# Altium project Oster-Platine.PrjPCB
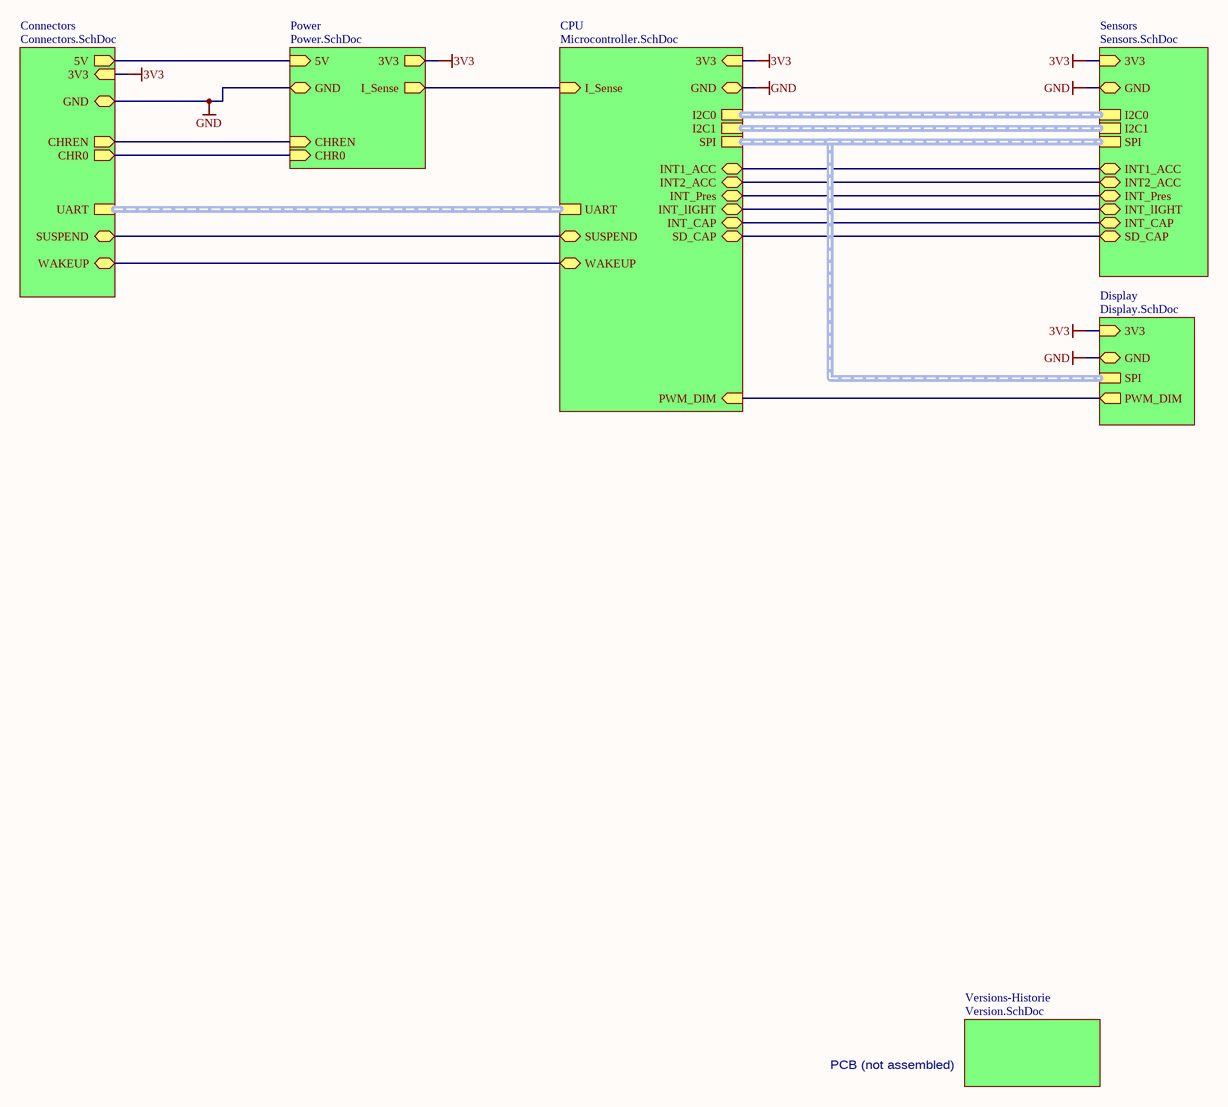
[diagram p0: Overview.SchDoc]
BAUGRUPPE: Bunny-PCB; PN1: 00400; PN2: 28669; PN3: 1; PN4: A
7 sheets, 136 parts. Net scope: strictly hierarchical (ports join the sheet entries above them; power ports are local).
Board file: Oster-Platine.PcbDoc
Sheets:
  Overview.SchDoc
    Versions-Historie = Version.SchDoc
    CPU = Microcontroller.SchDoc
    Display = Display.SchDoc
    Sensors = Sensors.SchDoc
    Power = Power.SchDoc
    Connectors = Connectors.SchDoc

## Sheet Overview.SchDoc
size 393 x 281 mm; Organization: iMAR GmbH; Address1: Im Reihersbruch 3; Address2: D-66386 St. Ingbert; Address3: www.imar.de; DocumentNumber: 2; SheetNumber: 2; SheetTotal: 7; Abteilung: Entwicklung

### Parts
PCB_(not_assembled)  PCB (not assembled)  (value not drawn)  (mechanical)

### Sub-sheets
Connectors = Connectors.SchDoc: 5V (out), GND (bidir), UART (harness UART), SUSPEND (bidir), WAKEUP (bidir), 3V3 (in), CHREN (out), CHR0 (out)
CPU = Microcontroller.SchDoc: 3V3 (in), GND (bidir), I2C0 (harness I2C), I2C1 (harness I2C), SPI (harness SPi), UART (harness UART), SUSPEND (bidir), WAKEUP (bidir), INT1_ACC (bidir), INT2_ACC (bidir), INT_Pres (bidir), INT_lIGHT (bidir), INT_CAP (bidir), SD_CAP (bidir), PWM_DIM (in), I_Sense (in)
Display = Display.SchDoc: SPI (harness SPI), 3V3 (in), GND (bidir), PWM_DIM (out)
Power = Power.SchDoc: 5V (in), 3V3 (out), GND (bidir), I_Sense (out), CHREN (in), CHR0 (in)
Sensors = Sensors.SchDoc: I2C0 (harness I2C), I2C1 (harness I2C), SPI (harness SPI), 3V3 (in), GND (bidir), INT1_ACC (bidir), INT2_ACC (bidir), INT_Pres (bidir), INT_lIGHT (bidir), INT_CAP (bidir), SD_CAP (bidir)
Versions-Historie = Version.SchDoc: no entries

### Nets
3V3: sheet CPU/3V3, sheet Display/3V3, sheet Sensors/3V3, sheet Power/3V3, sheet Connectors/3V3
5V: sheet Power/5V, sheet Connectors/5V
GND: sheet CPU/GND, sheet Display/GND, sheet Sensors/GND, sheet Power/GND, sheet Connectors/GND
CHR0: sheet Power/CHR0, sheet Connectors/CHR0
CHREN: sheet Power/CHREN, sheet Connectors/CHREN
I_Sense: sheet CPU/I_Sense, sheet Power/I_Sense
INT1_ACC: sheet CPU/INT1_ACC, sheet Sensors/INT1_ACC
INT2_ACC: sheet CPU/INT2_ACC, sheet Sensors/INT2_ACC
INT_CAP: sheet CPU/INT_CAP, sheet Sensors/INT_CAP
INT_lIGHT: sheet CPU/INT_lIGHT, sheet Sensors/INT_lIGHT
INT_Pres: sheet CPU/INT_Pres, sheet Sensors/INT_Pres
PWM_DIM: sheet CPU/PWM_DIM, sheet Display/PWM_DIM
SD_CAP: sheet CPU/SD_CAP, sheet Sensors/SD_CAP
SUSPEND: sheet CPU/SUSPEND, sheet Connectors/SUSPEND
WAKEUP: sheet CPU/WAKEUP, sheet Connectors/WAKEUP

### Buses and harness runs
harness sheet Connectors/UART = sheet CPU/UART
harness sheet CPU/I2C0 = sheet Sensors/I2C0
harness sheet CPU/I2C1 = sheet Sensors/I2C1
harness sheet CPU/SPI = sheet Display/SPI = sheet Sensors/SPI

### Notes on the sheet
- Date/Datum
- Name
- Identification No./Modell Nr.
- Classification/
- Checked
- Approved
- Issued
- Designation/Benennung
- Revision-Character/Versions-Buchstabe
- Verwendungsbereich
- Drawn/Hersteller
- Dept./Abt.
- iMAR Navigation GmbH
- Rev./Ver.
- Drawing No./Zeichnungsnummer
- Sheet/Blatt
- /
- Im Reihersbruch 3
- D-66386 St. Ingbert
- www.imar.de <http://www.imar.de>
- Filename/Dateiname
- Format
- A3

### Library data of the parts
PCB_(not_assembled) = CMP-ROOT-0069-7: iMAR_Partnumber: 00400-28669-1xxA; iMAR_Description: Bunny-PCB

## Sheet Version.SchDoc
size 393 x 281 mm; Organization: iMAR GmbH; Address1: Im Reihersbruch 3; Address2: D-66386 St. Ingbert; Address3: www.imar.de; DocumentNumber: 1; SheetNumber: 1; SheetTotal: 7; Abteilung: Entwicklung
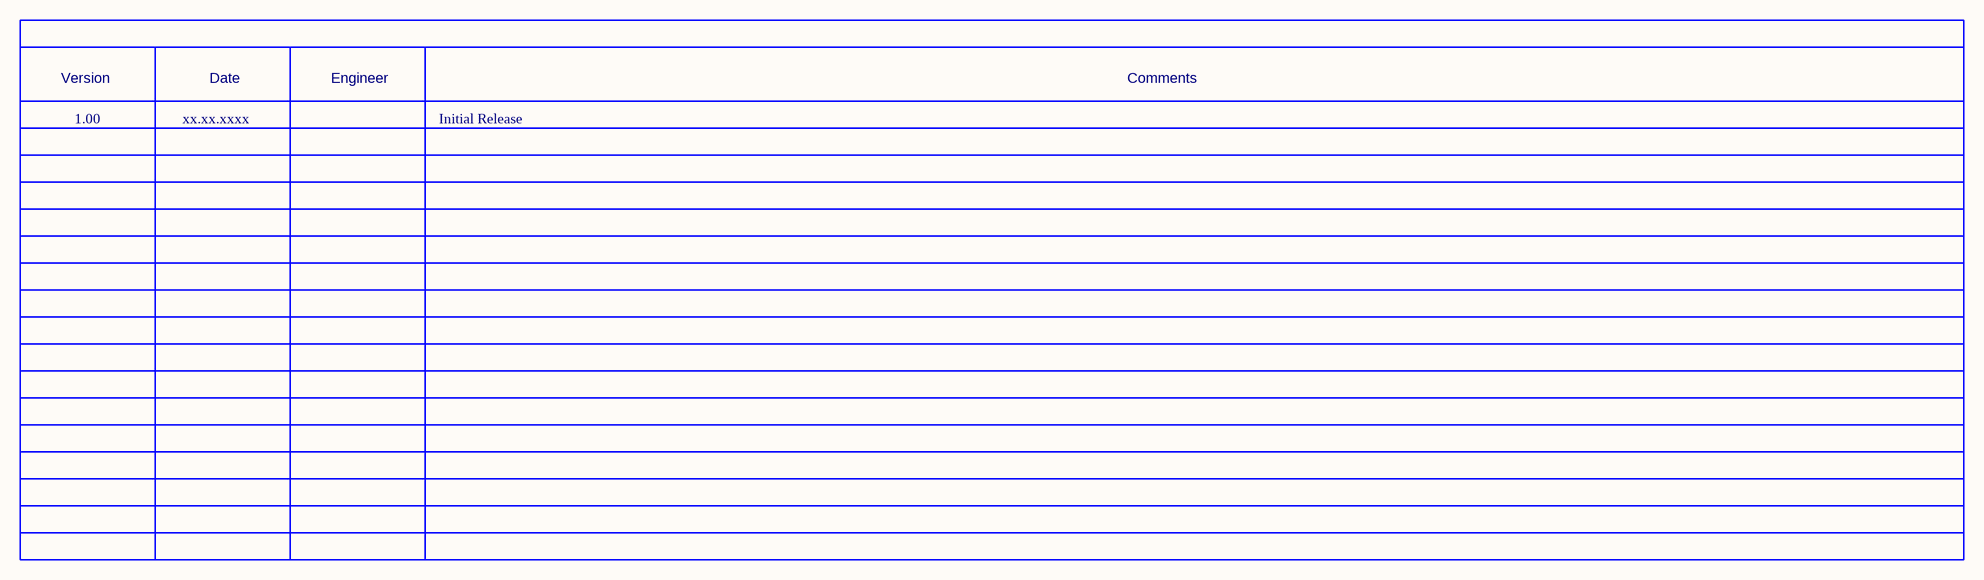
[diagram p1: Version.SchDoc]

### Notes on the sheet
- Version
- 1.00
- xx.xx.xxxx
- Date
- Engineer
- Initial Release
- Comments
- Date/Datum
- Name
- Identification No./Modell Nr.
- Classification/
- Checked
- Approved
- Issued
- Designation/Benennung
- Revision-Character/Versions-Buchstabe
- Verwendungsbereich
- Drawn/Hersteller
- Dept./Abt.
- iMAR Navigation GmbH
- Rev./Ver.
- Drawing No./Zeichnungsnummer
- Sheet/Blatt
- /
- Im Reihersbruch 3
- D-66386 St. Ingbert
- www.imar.de <http://www.imar.de>
- Filename/Dateiname
- Format
- A3

## Sheet Microcontroller.SchDoc
size 393 x 281 mm; DocumentNumber: 3; SheetNumber: 3; SheetTotal: 7; Format: A3; Abteilung: Entwicklung
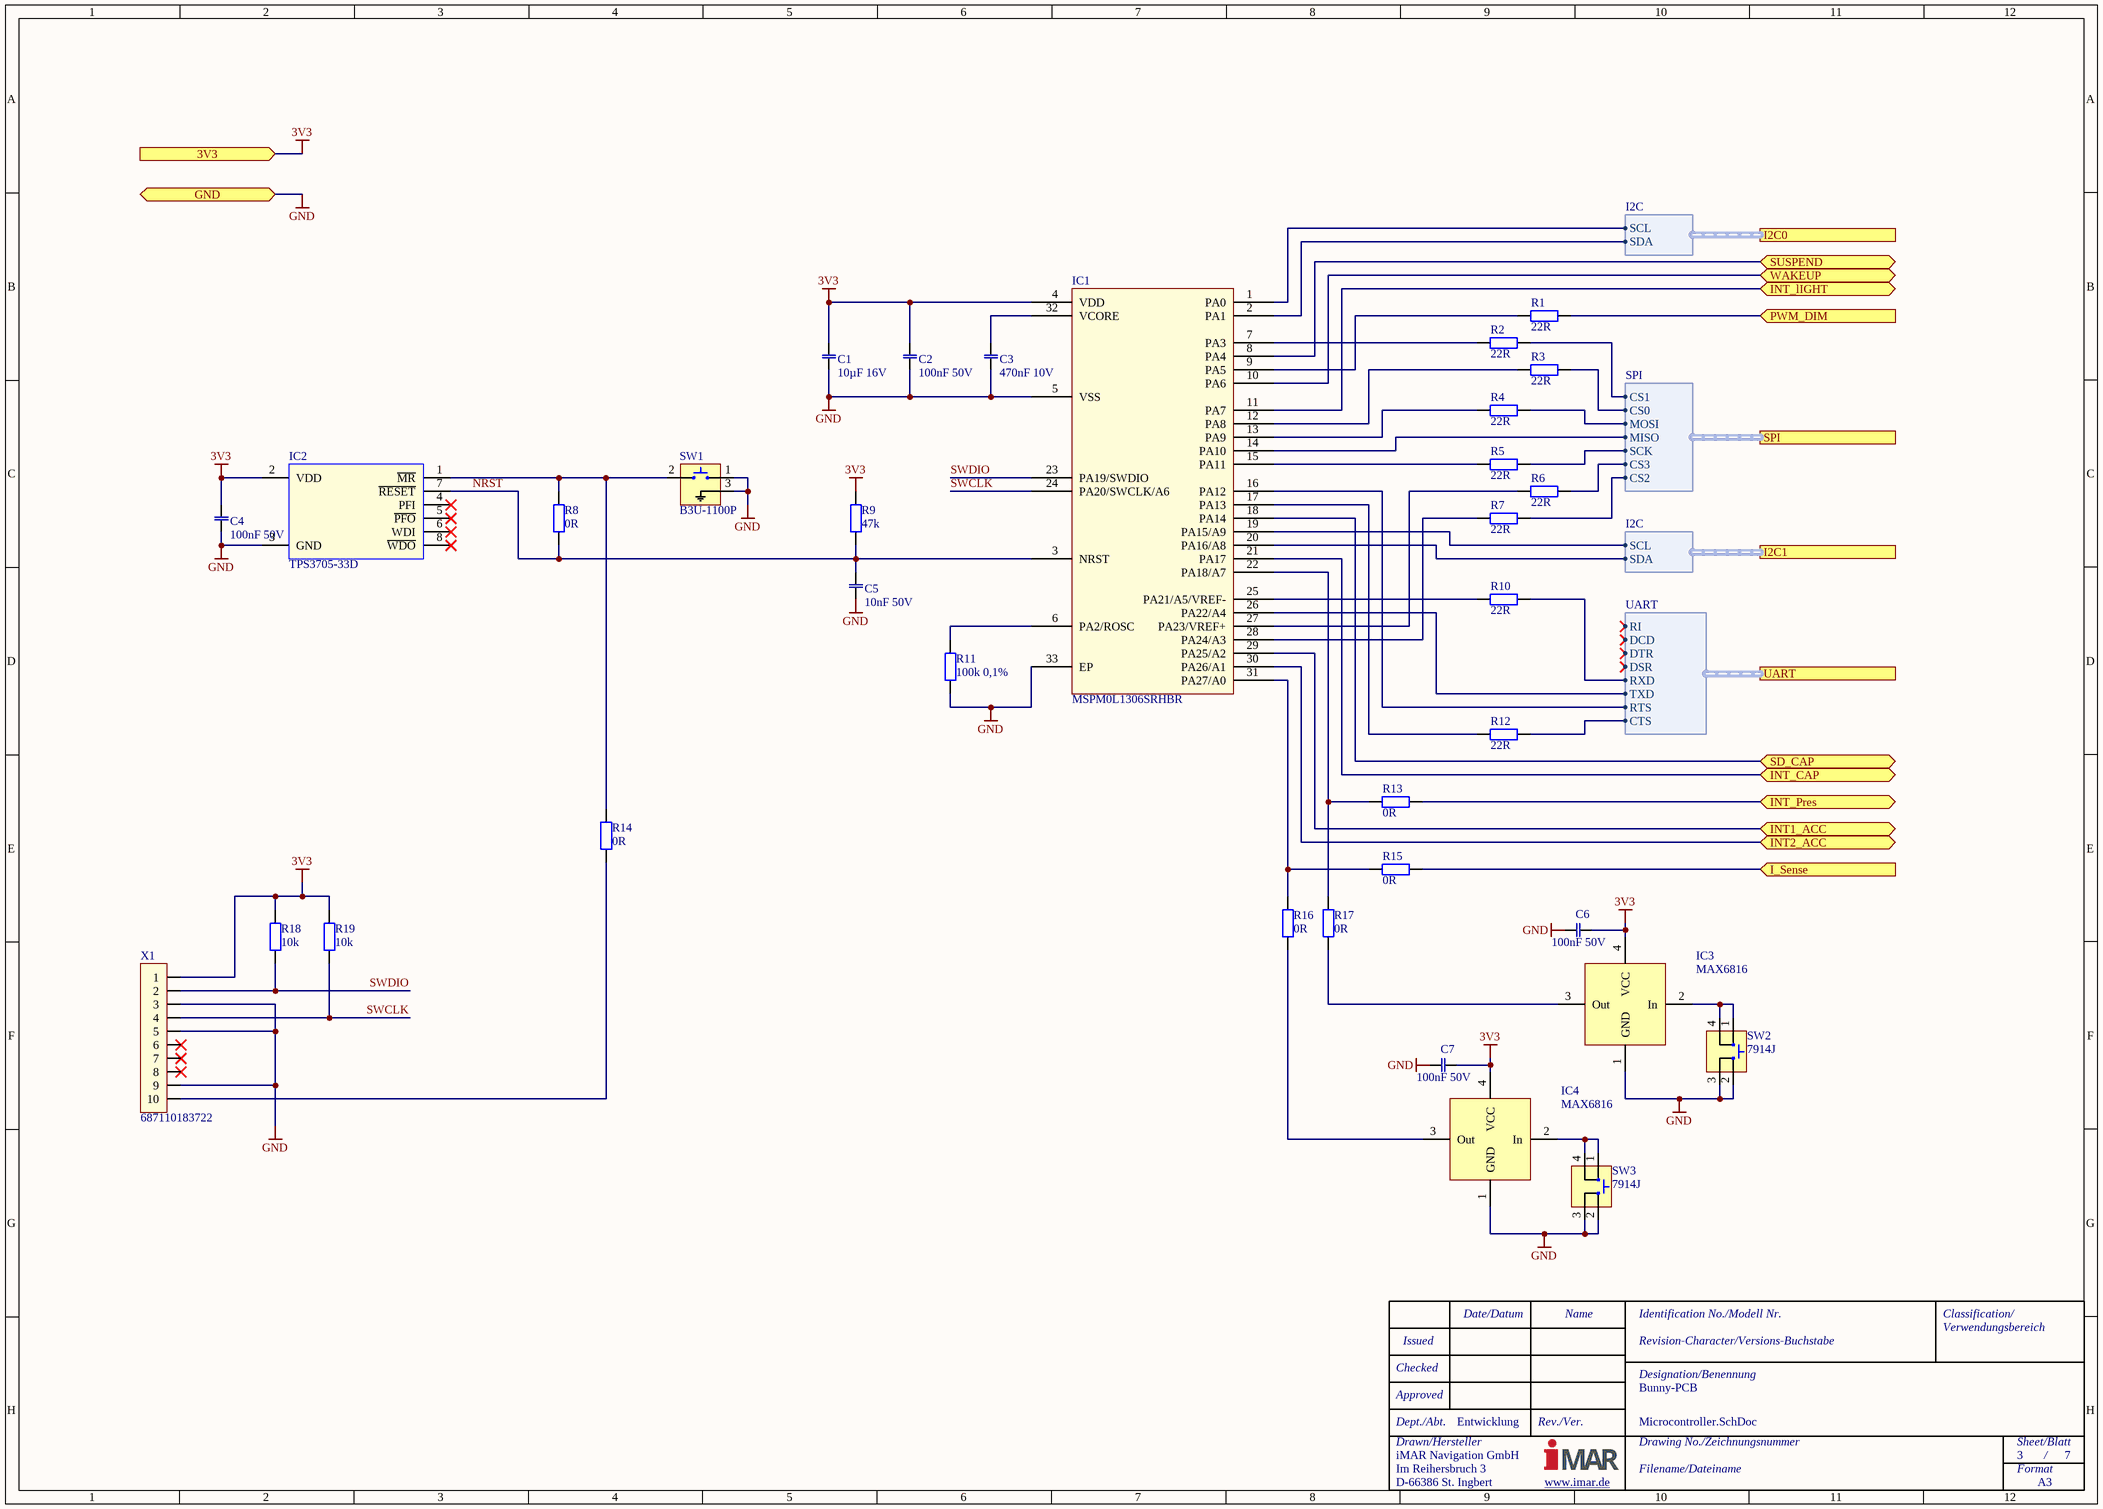
[diagram p2: Microcontroller.SchDoc]

### Parts
C1  10µF 16V  [CAPC1608L]
C2  100nF 50V  [CAPC1005N]
C3  470nF 10V  [CAPC1005N]
C4  100nF 50V  [CAPC1005N]
C5  10nF 50V  [CAPC1005N]
C6  100nF 50V  [CAPC1005N]
C7  100nF 50V  [CAPC1005N]
IC1  MSPM0L1306SRHBR  [QFN50P500X500X80_HS-33N]
IC2  TPS3705-33D  [SOIC127P600X175-8N]
IC3  MAX6816  [SOT190P237X120-4N]
IC4  MAX6816  [SOT190P237X120-4N]
R1  22R  [RESC1005L]
R2  22R  [RESC1005L]
R3  22R  [RESC1005L]
R4  22R  [RESC1005L]
R5  22R  [RESC1005L]
R6  22R  [RESC1005L]
R7  22R  [RESC1005L]
R8  0R  [RESC1005L]
R9  47k  [RESC1005L]
R10  22R  [RESC1005L]
R11  100k 0,1%  [RESC1005L]
R12  22R  [RESC1005L]
R13  0R  [RESC1005L]
R14  0R  [RESC1005L]
R15  0R  [RESC1005L]
R16  0R  [RESC1005L]
R17  0R  [RESC1005L]
R18  10k  [RESC1005L]
R19  10k  [RESC1005L]
SW1  B3U-1100P  [OMRON_B3U-1100P]
SW2  7914J  [BOURNS_7914J]
SW3  7914J  [BOURNS_7914J]
X1  687110183722  [WE_687110183722]

### Ports
3V3 (in), GND (bidir), I2C0 (harness I2C), I2C1 (harness I2C), I_Sense (in), INT1_ACC (bidir), INT2_ACC (bidir), INT_CAP (bidir), INT_lIGHT (bidir), INT_Pres (bidir), PWM_DIM (in), SD_CAP (bidir), SPI (harness SPi), SUSPEND (bidir), UART (harness UART), WAKEUP (bidir)

### Harnesses
I2C: SCL, SDA
SPI: CS0, MISO, MOSI, SCK, CS1, CS2, CS3
UART: RXD, DSR, DTR, RTS, CTS, TXD, DCD, RI

### Nets
3V3: C1.2 C2.2 C4.2 C6.2 C7.2 IC1.4(VDD) IC2.2(VDD) IC3.4(VCC) IC4.4(VCC) R9.2 R18.2 R19.2 X1.1 ; port 3V3
GND: C1.1 C2.1 C3.1 C4.1 C5.1 C6.1 C7.1 IC1.5(VSS) IC1.33(EP) IC2.3(GND) IC3.1(GND) IC4.1(GND) R11.1 SW1.1 SW1.3 SW2.2 SW2.3 SW3.2 SW3.3 X1.3 X1.5 X1.9 ; port GND
I_Sense: R15.1 ; port I_Sense
INT1_ACC: IC1.29(PA25/A2) ; port INT1_ACC
INT2_ACC: IC1.30(PA26/A1) ; port INT2_ACC
INT_CAP: IC1.21(PA17) ; port INT_CAP
INT_lIGHT: IC1.11(PA7) ; port INT_lIGHT
INT_Pres: R13.1 ; port INT_Pres
NRST: C5.2 IC1.3(NRST) IC2.7(~{RESET}) R8.1 R9.1
PWM_DIM: R1.2 ; port PWM_DIM
SD_CAP: IC1.18(PA14) ; port SD_CAP
SUSPEND: IC1.8(PA4) ; port SUSPEND
SWCLK: IC1.24(PA20/SWCLK/A6) R19.1 X1.4
SWDIO: IC1.23(PA19/SWDIO) R18.1 X1.2
WAKEUP: IC1.10(PA6) ; port WAKEUP
NetC3_2: C3.2 IC1.32(VCORE)
NetIC1_1: IC1.1(PA0) ; port I2C0.SCL
NetIC1_2: IC1.2(PA1) ; port I2C0.SDA
NetIC1_6: IC1.6(PA2/ROSC) R11.2
NetIC1_7: IC1.7(PA3) R2.1
NetIC1_9: IC1.9(PA5) R1.1
NetIC1_12: IC1.12(PA8) R3.1
NetIC1_13: IC1.13(PA9) R4.1
NetIC1_14: IC1.14(PA10) ; port SPI.MISO
NetIC1_15: IC1.15(PA11) R5.1
NetIC1_16: IC1.16(PA12) ; port UART.RTS
NetIC1_17: IC1.17(PA13) R12.1
NetIC1_19: IC1.19(PA15/A9) ; port I2C1.SCL
NetIC1_20: IC1.20(PA16/A8) ; port I2C1.SDA
NetIC1_22: IC1.22(PA18/A7) R13.2 R17.2
NetIC1_25: IC1.25(PA21/A5/VREF-) R10.1
NetIC1_26: IC1.26(PA22/A4) ; port UART.TXD
NetIC1_27: IC1.27(PA23/VREF+) R6.1
NetIC1_28: IC1.28(PA24/A3) R7.1
NetIC1_31: IC1.31(PA27/A0) R15.2 R16.2
NetIC2_1: IC2.1(~{MR}) R8.2 R14.2 SW1.2
NetIC3_2: IC3.2(In) SW2.1 SW2.4
NetIC3_3: IC3.3(Out) R17.1
NetIC4_2: IC4.2(In) SW3.1 SW3.4
NetIC4_3: IC4.3(Out) R16.1
NetIC7_2: R5.2 ; port SPI.SCK
NetIC7_4: R4.2 ; port SPI.MOSI
NetIC7_6: R2.2 ; port SPI.CS1
NetIC10_12: R3.2 ; port SPI.CS0
NetIC15_10: R7.2 ; port SPI.CS2
NetR6_2: R6.2 ; port SPI.CS3
NetR10_2: R10.2 ; port UART.RXD
NetR12_2: R12.2 ; port UART.CTS
NetR14_1: R14.1 X1.10

Not connected (* = marked no-connect by the designer): IC2 4(PFI)* 5(~{PFO})* 6(WDI)* 8(~{WDO})*; X1 6* 7* 8*

### Notes on the sheet
- Date/Datum
- Name
- Identification No./Modell Nr.
- Classification/
- Checked
- Approved
- Issued
- Designation/Benennung
- Revision-Character/Versions-Buchstabe
- Verwendungsbereich
- Drawn/Hersteller
- Dept./Abt.
- iMAR Navigation GmbH
- Rev./Ver.
- Drawing No./Zeichnungsnummer
- Sheet/Blatt
- /
- Im Reihersbruch 3
- D-66386 St. Ingbert
- www.imar.de <http://www.imar.de>
- Filename/Dateiname
- Format
- A3

### Library data of the parts
C1 = CMP-002-0021-13: 10µF  16V  Ceramic  0603  10%  X5R; Manufacturer_PN: unspecified; Failure_in_Time_value: 0,000123; iMAR_PN: 00001-08334-0001; Temperature_min: -55°C; Temperature_max: 85°C; Failure_in_Time_notes: 55°C, 90% Upper Confidence Level, Daten von Wuerth verwendet; Case/Package: 0603; Kategorie: X5R; iComment: 10µF 16V; Tolerance: 10%; Mount: SMD; RoHS: Yes; Value: 10µF; Capacitor_Type: Ceramic; Manufacturer: unspecified; Voltage: 16V
C2 C4 C6 C7 = CMP-002-0216-3: 100nF  50V  Ceramic  0402  10%  X7R; Manufacturer_PN: unspecified; Failure_in_Time_notes: 55°C, 90% Upper Confidence Level, Daten von Wuerth verwendet; Failure_in_Time_value: 0,000123; Temperature_min: -55°C; iMAR_PN: 00001-08791-0000; Temperature_max: 125°C; iComment: 100nF 50V; Capacitor_Type: Ceramic; Voltage: 50V; Mount: SMD; Case/Package: 0402; Manufacturer: unspecified; Kategorie: X7R; Tolerance: 10%; RoHS: Yes; Value: 100nF
C3 = CMP-002-0288-17: 470nF  10V  Ceramic  0402  10%  X5R; Manufacturer_PN: unspecified; Temperature_max: 85°C; iMAR_PN: 00001-08337-0001; Failure_in_Time_notes: 55°C, 90% Upper Confidence Level, Daten von Wuerth verwendet; Temperature_min: -55°C; Failure_in_Time_value: 0,000123; iComment: 470nF 10V; Kategorie: X5R; RoHS: Yes; Manufacturer: unspecified; Voltage: 10V; Tolerance: 10%; Value: 470nF; Mount: SMD; Capacitor_Type: Ceramic; Case/Package: 0402
C5 = CMP-002-0101-21: 10nF  50V  Ceramic  0402  10%  X7R; Manufacturer_PN: unspecified; Failure_in_Time_value: 0,000123; iMAR_PN: 00001-06474-0000; Temperature_min: -55°C; Kategorie: X7R(default); Failure_in_Time_notes: 55°C, 90% Upper Confidence Level, Daten von Wuerth verwendet; Temperature_max: 125°C; Capacitor_Type: Ceramic; Mount: SMD; iComment: 10nF 50V; RoHS: Yes; Manufacturer: unspecified; Voltage: 50V; Case/Package: 0402; Value: 10nF; Tolerance: 10%
IC1 = CMP-ROOT-00521-1: ARM Microcontrollers - MCU 32-MHz Arm Cortex - M0+ MCU with 64-KB; Manufacturer: TEXAS INSTRUMENTS; 3TG_Conformity: Yes; Temperature_min: -40°C; Frequency: 32MHz; Bus_Width: 32; Temperature_max: 125°C; Mount: SMD; Manufacturer_PN: MSPM0L1306SRHBR; Architecture: ARM; Case/Package: VQFN-32; RoHS: Yes; Pins: 32
IC2 = CMP-006-0029-4: Überwachungsschaltung, Active-Low, Push-Pull-Reset, 2 Überwachungsschaltungen, 2V-6Vin, SOIC-8; Manufacturer: TEXAS INSTRUMENTS; Temperature_max: 85°C; iMAR_PN: 00001-07756-0000; Temperature_min: -40°C; Pins: 8; Manufacturer_PN: TPS3705-33D; RoHS: Yes; Case/Package: SOIC-8; Mount: SMD
IC3 IC4 = CMP-006-0113-2: CMOS Switch Debouncers ±15kV ESD-Protected, Single/Dual/Octal,; Manufacturer: MAXIM INTEGRATED; Manufacturer_PN: MAX6816EUS+T; Failure_in_Time_value: 0,0134; iMAR_PN: 00001-06736-0000; Temperature_min: -40°C; Max Supply Voltage: 5.5V; Failure_in_Time_notes: 60% Upper Confidence Level; Min Supply Voltage: 2.7V; Temperature_max: 125°C; Mount: SMD; Case/Package: SOT-143; Pins: 4; RoHS: Yes
R1-R7 R10 R12 = CMP-001-0206-25: 22R  0402  62mW  1%  100ppm  50V; Manufacturer: unspecified; iComment: 22; Temperature_min: -40°C; Failure_in_Time_value: 0,0001; TK: ±100; Failure_in_Time_notes: 55°C, 60% Upper Confidence Level; Daten von Vishay verwendet; Temperature_max: 125°C; Value: 22; iMAR_PN: 00001-07283-0000; RoHS: Yes; Power: 62mW; Manufacturer_PN: unspecified; Case/Package: 0402; Tolerance: 1%; Voltage: 50V; Mount: SMD
R8 R13-R17 = CMP-001-0173-26: 0R  0402  0mW  0%  0ppm  0V; Manufacturer: unspecified; iMAR_PN: 00001-06483-0000; Temperature_min: -40°C; Failure_in_Time_notes: 55°C, 60% Upper Confidence Level; Daten von Vishay verwendet; iComment: 0; Power: 0W; Failure_in_Time_value: 0,0001; Value: 0; Temperature_max: 125°C; Voltage: 0V; Case/Package: 0402; Mount: SMD; Tolerance: 0%; TK: 0; RoHS: Yes; Manufacturer_PN: unspecified
R9 = CMP-001-0286-24: 47k  0402  62mW  1%  100ppm  50V; Manufacturer: unspecified; iMAR_PN: 00001-07334-0000; Temperature_max: 125°C; Temperature_min: -40°C; Failure_in_Time_value: 0,0001; Failure_in_Time_notes: 55°C, 60% Upper Confidence Level; Daten von Vishay verwendet; TK: ±100; Power: 62mW; Manufacturer_PN: unspecified; Tolerance: 1%; Value: 47k; Mount: SMD; RoHS: Yes; iComment: 47k; Voltage: 50V; Case/Package: 0402
R11 = CMP-001-0490-2: 100k  0402  62mW  0,1%  25ppm  50V; Manufacturer_PN: unspecified; iMAR_PN: 00001-09293-0000; Failure_in_Time_value: 0,0001; Temperature_min: -40°C; Temperature_max: 125°C; TK: ±100; Tolerance: 0.1%; Failure_in_Time_notes: 55°C, 60% Upper Confidence Level; Daten von Vishay verwendet; Power: 62mW; Mount: SMD; Voltage: 50V; RoHS: Yes; Case/Package: 0402; Value: 100k; Manufacturer: unspecified; iComment: 100k
R18 R19 = CMP-001-0270-23: 10k  0402  62mW  1%  100ppm  50V; Manufacturer: unspecified; Failure_in_Time_notes: 55°C, 60% Upper Confidence Level; Daten von Vishay verwendet; Failure_in_Time_value: 0,0001; Temperature_min: -40°C; TK: ±100; iMAR_PN: 00001-06144-0004; Temperature_max: 125°C; RoHS: Yes; Value: 10k; Mount: SMD; iComment: 10k; Case/Package: 0402; Power: 62mW; Manufacturer_PN: unspecified; Tolerance: 1%; Voltage: 50V
SW1 = CMP-ROOT-00528-1: Keypad Switch, 1 Switches, SPST, Momentary-tactile, 0.05A, 12VDC, 1.99N, Solder Terminal, Surface Mount-straight; Manufacturer: OMRON; Temperature_max: 70°C; Temperature_min: -25°C; RoHS: Yes; Pins: 3; Manufacturer_PN: B3U-1100P; Mount: SMD; Case/Package: SMT; Function: SPST
SW2 SW3 = CMP-013-0003-7: SMD Pushbutton Sealed; Manufacturer_PN: 7914J-1-000; Manufacturer: BOURNS; Function: OFF-(ON); iMAR_PN: 00001-06159-0000; Failure_in_Time_notes: Ground Benign; MIL_HDBK_217F; Switch/ Toggle or Push Button; Temperature_max: 125°C; Temperature_min: -55°C; Failure_in_Time_value: 0,1; Mount: SMD; Case/Package: 7914J; Pins: 4; RoHS: Yes
X1 = CMP-ROOT-00282-3: WR-FPC 0.50 mm SMT ZIF Horizontal Bottom Contact; Manufacturer: WUERTH ELEKTRONIK; iMAR_PN: 00003-07451-0000; Heigth: 1.2mm; Connector_Type: btw; Number_of_Rows: 1; System: Connector; Temperature_min: -25°C; Pitch: 0,5mm; Temperature_max: 85°C; Mount: SMD; Length: 10.7mm; Manufacturer_PN: 687110183722; RoHS: Yes; Width: 4.25mm; Pins: 10

## Sheet Display.SchDoc
size 393 x 281 mm; DocumentNumber: 7; SheetNumber: 7; SheetTotal: 7; Format: A3; Abteilung: Entwicklung
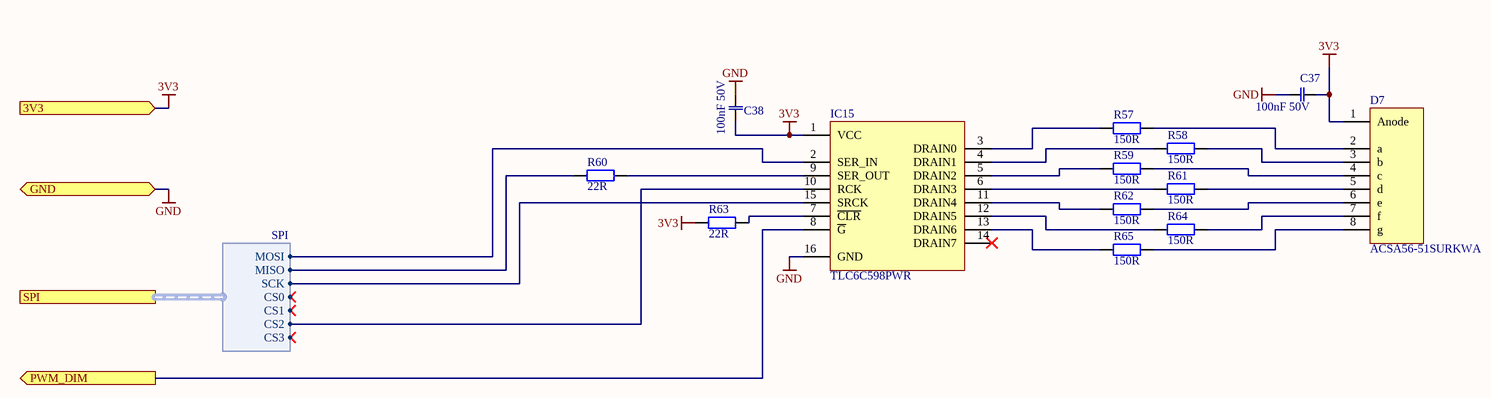
[diagram p3: Display.SchDoc]

### Parts
C37  100nF 50V  [CAPC1005N]
C38  100nF 50V  [CAPC1005N]
D7  ACSA56-51SURKWA  [ACSA56-51SURKWA]
IC15  TLC6C598PWR  [TSSOP65P640X120-16N]
R57  150R  [RESC1005L]
R58  150R  [RESC1005L]
R59  150R  [RESC1005L]
R60  22R  [RESC1005L]
R61  150R  [RESC1005L]
R62  150R  [RESC1005L]
R63  22R  [RESC1005L]
R64  150R  [RESC1005L]
R65  150R  [RESC1005L]

### Ports
3V3 (in), GND (bidir), PWM_DIM (out), SPI (harness SPI)

### Harnesses
SPI: CS0, MISO, MOSI, SCK, CS1, CS2, CS3

### Nets
3V3: C37.1 C38.1 D7.1(Anode) IC15.1(VCC) R63.1 ; port 3V3
GND: C37.2 C38.2 IC15.16(GND) ; port GND
PWM_DIM: IC15.8(~{G}) ; port PWM_DIM
NetD7_2: D7.2(a) R57.2
NetD7_3: D7.3(b) R58.2
NetD7_4: D7.4(c) R59.2
NetD7_5: D7.5(d) R61.2
NetD7_6: D7.6(e) R62.2
NetD7_7: D7.7(f) R64.2
NetD7_8: D7.8(g) R65.2
NetIC1_14: R60.1 ; port SPI.MISO
NetIC7_2: IC15.15(SRCK) ; port SPI.SCK
NetIC7_4: IC15.2(SER_IN) ; port SPI.MOSI
NetIC15_3: IC15.3(DRAIN0) R57.1
NetIC15_4: IC15.4(DRAIN1) R58.1
NetIC15_5: IC15.5(DRAIN2) R59.1
NetIC15_6: IC15.6(DRAIN3) R61.1
NetIC15_7: IC15.7(~{CLR}) R63.2
NetIC15_9: IC15.9(SER_OUT) R60.2
NetIC15_10: IC15.10(RCK) ; port SPI.CS2
NetIC15_11: IC15.11(DRAIN4) R62.1
NetIC15_12: IC15.12(DRAIN5) R64.1
NetIC15_13: IC15.13(DRAIN6) R65.1

Not connected (* = marked no-connect by the designer): IC15 14(DRAIN7)*

### Notes on the sheet
- Date/Datum
- Name
- Identification No./Modell Nr.
- Classification/
- Checked
- Approved
- Issued
- Designation/Benennung
- Revision-Character/Versions-Buchstabe
- Verwendungsbereich
- Drawn/Hersteller
- Dept./Abt.
- iMAR Navigation GmbH
- Rev./Ver.
- Drawing No./Zeichnungsnummer
- Sheet/Blatt
- /
- Im Reihersbruch 3
- D-66386 St. Ingbert
- www.imar.de <http://www.imar.de>
- Filename/Dateiname
- Format
- A3

### Library data of the parts
C37 C38 = CMP-002-0216-3: as C2 on sheet Microcontroller; iComment: 100nF 50V; Capacitor_Type: Ceramic; Voltage: 50V; Mount: SMD; Case/Package: 0402; Manufacturer: unspecified; Kategorie: X7R; Tolerance: 10%; RoHS: Yes; Value: 100nF
D7 = CMP-ROOT-00525-1: Smart/Normal 7 Seg Numeric LED Display; pin to pad: 1>3+8 2>7 3>6 5>2 6>1 7>9 8>5+10; Manufacturer: Kingbright; Power: 75mW; Temperature_min: -40°C; Uf: 1.95V; Color: Red; Temperature_max: 85°C; If: 20mA; Ub: 5V; 3TG_Conformity: Yes; Manufacturer_PN: ACSA56-51SURKWA; Type: LED; Case/Package: 7 Segment; Mount: SMD; RoHS: Yes; Pins: 10
IC15 = CMP-006-0135-1: LED Driver, 8-Segment, PDSO16; Manufacturer: TEXAS INSTRUMENTS; iMAR_PN: tbd; Temperature_max: 105°C; 3TG_Conformity: Yes; Temperature_min: -40°C; Mount: SMD; Case/Package: TSSOP-16; Pins: 16; Manufacturer_PN: TLC6C598PWR; RoHS: Yes
R57-R59 R61 R62 R64 R65 = CMP-001-0226-23: 150R  0402  62mW  1%  100ppm  50V; Manufacturer: unspecified; Failure_in_Time_notes: 55°C, 60% Upper Confidence Level; Daten von Vishay verwendet; iMAR_PN: 00001-08393-0000; Value: 150; Temperature_max: 125°C; TK: ±100; Failure_in_Time_value: 0,0001; Temperature_min: -40°C; Power: 62mW; Voltage: 50V; Tolerance: 1%; RoHS: Yes; Case/Package: 0402; Manufacturer_PN: unspecified; iComment: 150; Mount: SMD
R60 R63 = CMP-001-0206-25: as R1 on sheet Microcontroller; RoHS: Yes; Power: 62mW; Manufacturer_PN: unspecified; Case/Package: 0402; Tolerance: 1%; Voltage: 50V; Mount: SMD

## Sheet Sensors.SchDoc
size 393 x 281 mm; DocumentNumber: 6; SheetNumber: 6; SheetTotal: 7; Format: A3; Abteilung: Entwicklung
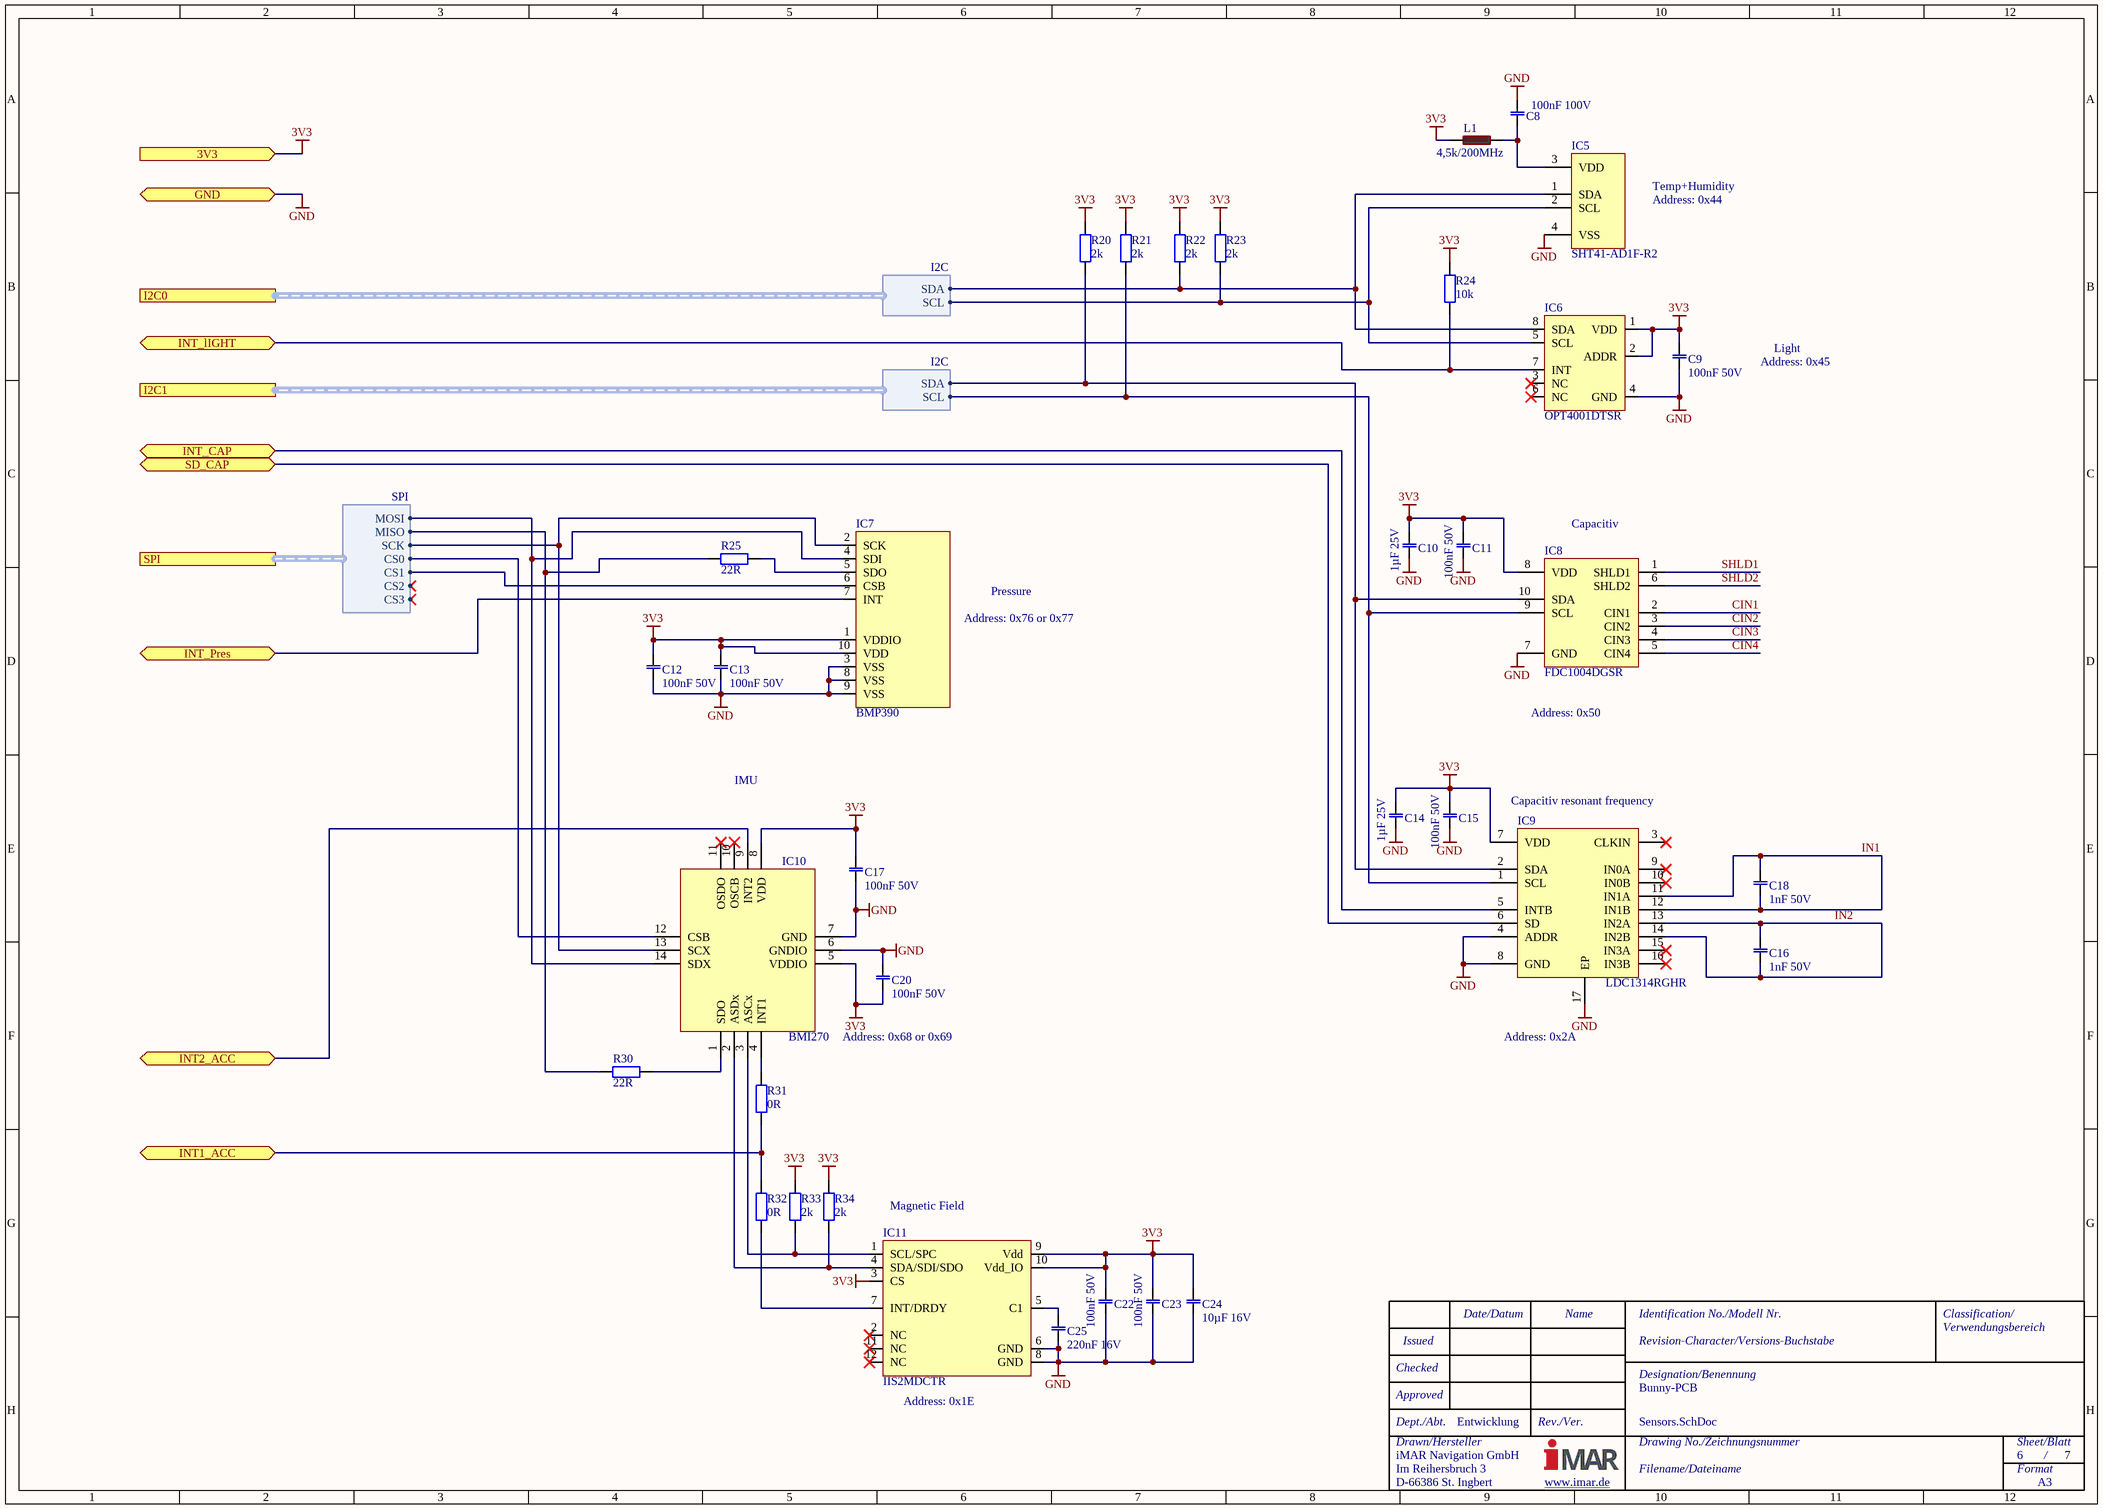
[diagram p4: Sensors.SchDoc]

### Parts
C8  100nF 100V  [CAPC1608L]
C9  100nF 50V  [CAPC1005N]
C10  1µF 25V  [CAPC1005N]
C11  100nF 50V  [CAPC1005N]
C12  100nF 50V  [CAPC1005N]
C13  100nF 50V  [CAPC1005N]
C14  1µF 25V  [CAPC1005N]
C15  100nF 50V  [CAPC1005N]
C16  1nF 50V  [CAPC1608L]
C17  100nF 50V  [CAPC1005N]
C18  1nF 50V  [CAPC1608L]
C20  100nF 50V  [CAPC1005N]
C22  100nF 50V  [CAPC1005N]
C23  100nF 50V  [CAPC1005N]
C24  10µF 16V  [CAPC1608L]
C25  220nF 16V  [CAPC1005N]
IC5  SHT41-AD1F-R2  [SENSIRION_SHT4x]
IC6  OPT4001DTSR  [SOT50P160X60-8N]
IC7  BMP390  [BMP390]
IC8  FDC1004DGSR  [TSSOP50P490X110-10N]
IC9  LDC1314RGHR  [QFN65P400X400X80_HS-17N]
IC10  BMI270  [BOSCH_LGA14_BMI_vergroesserte_Pads]
IC11  IIS2MDCTR  [ST_IIS2MDCTR_LGA12C50P4X4_200X200X70]
L1  4,5k/200MHz  [IND_WE_CBF_0603_Wide_Band]
R20  2k  [RESC1005L]
R21  2k  [RESC1005L]
R22  2k  [RESC1005L]
R23  2k  [RESC1005L]
R24  10k  [RESC1005L]
R25  22R  [RESC1005L]
R30  22R  [RESC1005L]
R31  0R  [RESC1005L]
R32  0R  [RESC1005L]
R33  2k  [RESC1005L]
R34  2k  [RESC1005L]

### Ports
3V3 (in), GND (bidir), I2C0 (harness I2C), I2C1 (harness I2C), INT1_ACC (bidir), INT2_ACC (bidir), INT_CAP (bidir), INT_lIGHT (bidir), INT_Pres (bidir), SD_CAP (bidir), SPI (harness SPI)

### Harnesses
I2C: SCL, SDA
SPI: CS0, MISO, MOSI, SCK, CS1, CS2, CS3

### Nets
3V3: C9.2 C10.2 C11.2 C12.2 C13.2 C14.2 C15.2 C17.2 C20.1 C22.2 C23.2 C24.2 IC6.1(VDD) IC6.2(ADDR) IC7.1(VDDIO) IC7.10(VDD) IC8.8(VDD) IC9.7(VDD) IC10.5(VDDIO) IC10.8(VDD) IC11.3(CS) IC11.9(Vdd) IC11.10(Vdd_IO) L1.1 R20.2 R21.2 R22.2 R23.2 R24.2 R33.2 R34.2 ; port 3V3
GND: C8.1 C9.1 C10.1 C11.1 C12.1 C13.1 C14.1 C15.1 C17.1 C20.2 C22.1 C23.1 C24.1 C25.2 IC5.4(VSS) IC6.4(GND) IC7.3(VSS) IC7.8(VSS) IC7.9(VSS) IC8.7(GND) IC9.4(ADDR) IC9.8(GND) IC9.17(EP) IC10.6(GNDIO) IC10.7(GND) IC11.6(GND) IC11.8(GND) ; port GND
CIN1: IC8.2(CIN1)
CIN2: IC8.3(CIN2)
CIN3: IC8.4(CIN3)
CIN4: IC8.5(CIN4)
IN1: C18.1 C18.2 IC9.11(IN1A) IC9.12(IN1B)
IN2: C16.1 C16.2 IC9.13(IN2A) IC9.14(IN2B)
INT1_ACC: R31.1 R32.2 ; port INT1_ACC
INT2_ACC: IC10.9(INT2) ; port INT2_ACC
INT_CAP: IC9.5(INTB) ; port INT_CAP
INT_lIGHT: IC6.7(INT) R24.1 ; port INT_lIGHT
INT_Pres: IC7.7(INT) ; port INT_Pres
SD_CAP: IC9.6(SD) ; port SD_CAP
SHLD1: IC8.1(SHLD1)
SHLD2: IC8.6(SHLD2)
NetC8_2: C8.2 IC5.3(VDD) L1.2
NetC25_1: C25.1 IC11.5(C1)
NetIC1_1: IC5.2(SCL) IC6.5(SCL) R23.1 ; port I2C0.SCL
NetIC1_2: IC5.1(SDA) IC6.8(SDA) R22.1 ; port I2C0.SDA
NetIC1_14: R25.1 R30.1 ; port SPI.MISO
NetIC1_19: IC8.9(SCL) IC9.1(SCL) R21.1 ; port I2C1.SCL
NetIC1_20: IC8.10(SDA) IC9.2(SDA) R20.1 ; port I2C1.SDA
NetIC7_2: IC7.2(SCK) IC10.13(SCX) ; port SPI.SCK
NetIC7_4: IC7.4(SDI) IC10.14(SDX) ; port SPI.MOSI
NetIC7_5: IC7.5(SDO) R25.2
NetIC7_6: IC7.6(CSB) ; port SPI.CS1
NetIC10_1: IC10.1(SDO) R30.2
NetIC10_2: IC10.2(ASDx) IC11.4(SDA/SDI/SDO) R34.1
NetIC10_3: IC10.3(ASCx) IC11.1(SCL/SPC) R33.1
NetIC10_4: IC10.4(INT1) R31.2
NetIC10_12: IC10.12(CSB) ; port SPI.CS0
NetIC11_7: IC11.7(INT/DRDY) R32.1

Not connected (* = marked no-connect by the designer): IC6 3(NC)* 6(NC)*; IC9 3(CLKIN)* 9(IN0A)* 10(IN0B)* 15(IN3A)* 16(IN3B)*; IC10 10(OSCB)* 11(OSDO)*; IC11 2(NC)* 11(NC)* 12(NC)*

### Notes on the sheet
- Temp+Humidity
- Address: 0x44
- Address: 0x45
- Light
- (near IC8) Capacitiv
- Address: 0x76 or 0x77
- Pressure
- Address: 0x50
- IMU
- (near IC9) Capacitiv resonant frequency
- (near IC10) Address: 0x68 or 0x69
- Address: 0x2A
- Magnetic Field
- (near IC11) Address: 0x1E
- Date/Datum
- Name
- Identification No./Modell Nr.
- Classification/
- Checked
- Approved
- Issued
- Designation/Benennung
- Revision-Character/Versions-Buchstabe
- Verwendungsbereich
- Drawn/Hersteller
- Dept./Abt.
- iMAR Navigation GmbH
- Rev./Ver.
- Drawing No./Zeichnungsnummer
- Sheet/Blatt
- /
- Im Reihersbruch 3
- D-66386 St. Ingbert
- www.imar.de <http://www.imar.de>
- Filename/Dateiname
- Format
- A3

### Library data of the parts
C8 = CMP-002-0220-3: 100nF  100V  Ceramic  0603  10%  X7R; Manufacturer_PN: unspecified; Failure_in_Time_value: 0,000123; iMAR_PN: 00001-08261-0000; Temperature_min: -55°C; Failure_in_Time_notes: 55°C, 90% Upper Confidence Level, Daten von Wuerth verwendet; Temperature_max: 125°C; Value: 100nF; Mount: SMD; Kategorie: X7R; Case/Package: 0603; iComment: 100nF 100V; Voltage: 100V; Manufacturer: unspecified; RoHS: Yes; Tolerance: 10%; Capacitor_Type: Ceramic
C9 C11-C13 C15 C17 C20 C22 C23 = CMP-002-0216-3: as C2 on sheet Microcontroller; iComment: 100nF 50V; Capacitor_Type: Ceramic; Voltage: 50V; Mount: SMD; Case/Package: 0402; Manufacturer: unspecified; Kategorie: X7R; Tolerance: 10%; RoHS: Yes; Value: 100nF
C10 C14 = CMP-002-0152-6: 1µF  25V  Ceramic  0402  10%  X5R; Manufacturer_PN: unspecified; iMAR_PN: 00001-07601-0000; Temperature_max: 85°C; Temperature_min: -55°C; RoHS: Yes; Mount: SMD; iComment: 1µF 25V; Voltage: 25V; Capacitor_Type: Ceramic; Kategorie: X5R; Manufacturer: unspecified; Value: 1µF; Case/Package: 0402; Tolerance: 10%
C16 C18 = CMP-0001-00018-3: 1nF 50V Ceramic 0603 1% C0G(NP0); Manufacturer: VISHAY; Manufacturer_PN: VJ0603A102FXACW1BC; Temperature_max: 125°C; iMAR_PN: 00001-09139-0000; Temperature_min: -55°C; Mount: SMD; Tolerance: 1%; RoHS: Yes; Capacitor_Type: Ceramic; iComment: 1nF 50V; Kategorie: C0G(NP0); Case/Package: 0603; Value: 1nF; Voltage: 50V
C24 = CMP-002-0021-13: as C1 on sheet Microcontroller; Case/Package: 0603; Kategorie: X5R; iComment: 10µF 16V; Tolerance: 10%; Mount: SMD; RoHS: Yes; Value: 10µF; Capacitor_Type: Ceramic; Manufacturer: unspecified; Voltage: 16V
C25 = CMP-002-0142-8: 220nF  16V  Ceramic  0402  10%  X7R; Manufacturer: unspecified; Temperature_min: -55°C; Temperature_max: 125°C; iMAR_PN: 00001-08053-0000; Voltage: 16V; Mount: SMD; Kategorie: X7R; Manufacturer_PN: unspecified; Value: 220nF; Case/Package: 0402; Tolerance: 10%; RoHS: Yes; Capacitor_Type: Ceramic; iComment: 220nF 16V
IC5 = CMP-ROOT-00469-2: Digital humidity and temperature sensor, ±1.8% / max. ±3.5% RH; Manufacturer: SENSIRION; Temperature_max: 125°C; Typ: Temperature/Humidity; Temperature_min: -40°C; iMAR_PN: 00500-35042-0001; RoHS: Yes; Manufacturer_PN: SHT41-AD1F-R2; Mount: SMD; Case/Package: DFN; Pins: 4
IC6 = CMP-ROOT-00519-1: High-speed high-precision digital ambient light sensor (ALS); Manufacturer: TEXAS INSTRUMENTS; Temperature_min: -40°C; Temperature_max: 85°C; 3TG_Conformity: Yes; Manufacturer_PN: OPT4001DTSR; Mount: SMD; Pins: 8; Typ: Light; RoHS: Yes; Case/Package: SOT5X3
IC7 = CMP-ROOT-00308-4: Pressure Sensor; Manufacturer: BOSCH; Temperature_min: -40°C; Temperature_max: 85°C; iMAR_PN: 00500-35035-0001; Pins: 10; Manufacturer_PN: BMP390; Mount: SMD; Case/Package: LGA10; RoHS: Yes
IC8 = CMP-006-0133-1: 4-Channel Capacitance-to-Digital Converter for Capacitive Sensing Applications; Manufacturer: TEXAS INSTRUMENTS; 3TG_Conformity: Yes; Temperature_max: 125°C; Temperature_min: -40°C; Manufacturer_PN: FDC1004DGSR; Mount: SMD; Pins: 10; RoHS: Yes; Case/Package: VSSOP
IC9 = CMP-006-0132-1: Data Acquisition ADCs/DACs - Specialised 12-bit Inductance- t o-Digital Converter; Manufacturer: TEXAS INSTRUMENTS; iMAR_PN: tbd; Temperature_max: 125°C; Temperature_min: -40°C; 3TG_Conformity: Yes; Pins: 16; Mount: SMD; Case/Package: QFN-16; Manufacturer_PN: LDC1314RGHR; RoHS: Yes
IC10 = CMP-ROOT-00126-2: 6-axis, smart, low-power Inertial Measurement Unit; Manufacturer: BOSCH; Typ: IMU; Temperature_max: 85°C; iMAR_PN: 00500-21006-0001; Temperature_min: -40°C; Manufacturer_PN: BMI270; Pins: 14; Mount: SMD; Case/Package: LGA14; RoHS: Yes
IC11 = CMP-ROOT-00520-1: High accuracy, ultra-low-power ,3-axis digital output magnetometer; Manufacturer: ST Microelectronics; Temperature_max: 85°C; Temperature_min: -40°C; 3TG_Conformity: Yes; Mount: SMD; Manufacturer_PN: IIS2MDCTR; RoHS: Yes; Case/Package: LGA-12; Pins: 12; Typ: Magnetometer
L1 = CMP-007-0061-8: 4,5k/200MHz  500mA  0603  WE-CBF SMD EMI Suppression Ferrite Bead; Manufacturer: WUERTH ELEKTRONIK; Manufacturer_PN: 742792653; Frequency: 200MHz; Impedance: 4.5k; Temperature_max: 85°C; Temperature_min: -55°C; Failure_in_Time_notes: 90% UCL (lambda: 0,13; sigma: 0,09); Failure_in_Time_value: 0,00025; Impedance_100MHz: 600; Impedance_DC: 0.65; Temperature_extended: 125°C; iMAR_PN: 00001-04551-0000; Case/Package: 0603; Mount: SMD; RoHS: Yes; Current_Rated: 500mA
R20-R23 R33 R34 = CMP-001-0253-23: 2k  0402  62mW  1%  100ppm  50V; Manufacturer_PN: unspecified; Failure_in_Time_notes: 55°C, 60% Upper Confidence Level; Daten von Vishay verwendet; Failure_in_Time_value: 0,0001; Temperature_min: -40°C; iMAR_PN: 00001-07598-0000; TK: ±100; Temperature_max: 125°C; Power: 62mW; Case/Package: 0402; Tolerance: 1%; Voltage: 50V; RoHS: Yes; Manufacturer: unspecified; iComment: 2k; Value: 2k; Mount: SMD
R24 = CMP-001-0270-23: as R18 on sheet Microcontroller; RoHS: Yes; Value: 10k; Mount: SMD; iComment: 10k; Case/Package: 0402; Power: 62mW; Manufacturer_PN: unspecified; Tolerance: 1%; Voltage: 50V
R25 R30 = CMP-001-0206-25: as R1 on sheet Microcontroller; RoHS: Yes; Power: 62mW; Manufacturer_PN: unspecified; Case/Package: 0402; Tolerance: 1%; Voltage: 50V; Mount: SMD
R31 R32 = CMP-001-0173-26: as R8 on sheet Microcontroller; Voltage: 0V; Case/Package: 0402; Mount: SMD; Tolerance: 0%; TK: 0; RoHS: Yes; Manufacturer_PN: unspecified

## Sheet Power.SchDoc
size 393 x 281 mm; DocumentNumber: 5; SheetNumber: 5; SheetTotal: 7; Format: A3; Abteilung: Entwicklung
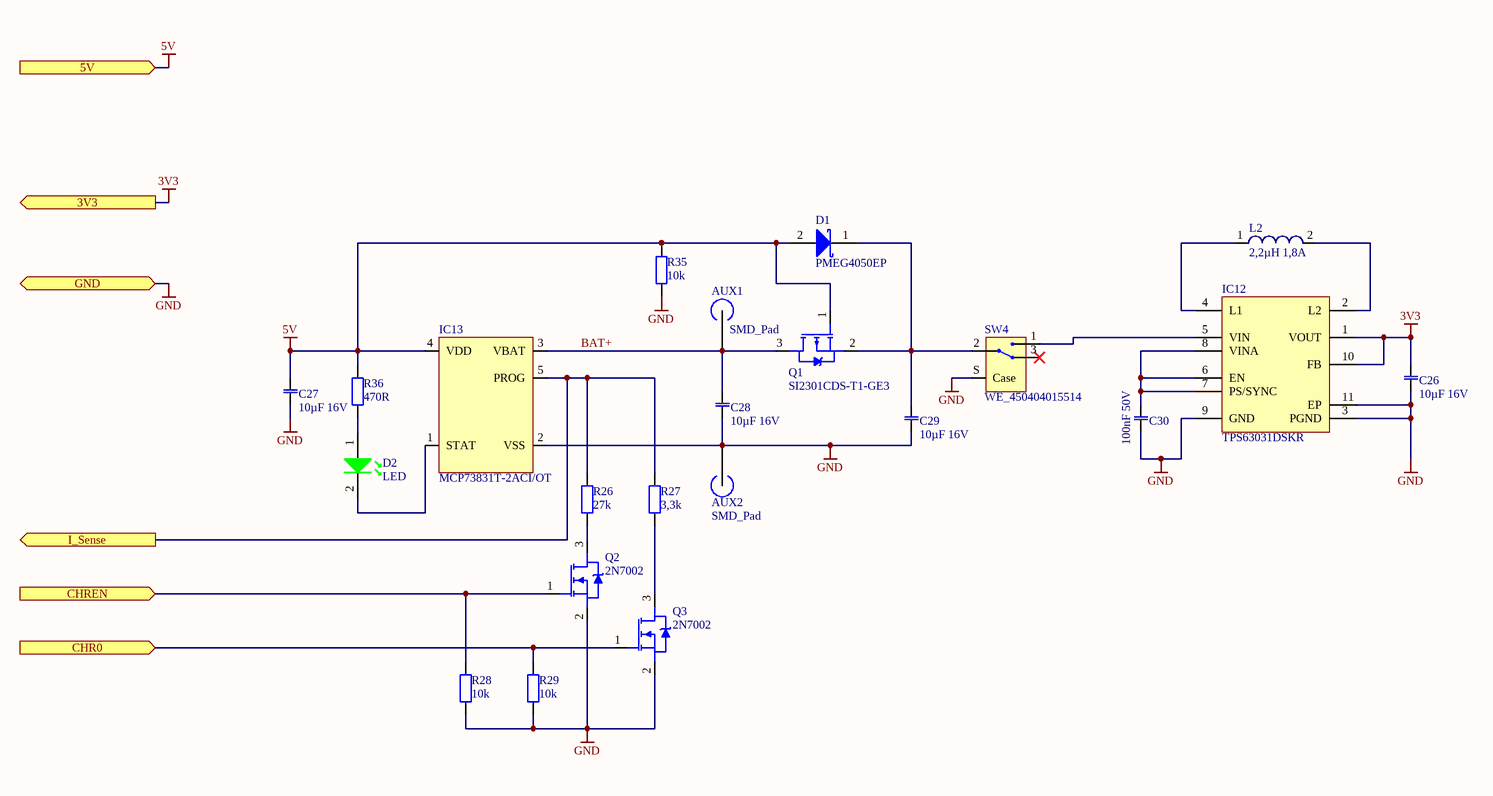
[diagram p5: Power.SchDoc]

### Parts
AUX1  SMD_Pad  [SMD_PAD]  (no BOM)
AUX2  SMD_Pad  [SMD_PAD]  (no BOM)
C26  10µF 16V  [CAPC1608L]
C27  10µF 16V  [CAPC1608L]
C28  10µF 16V  [CAPC1608L]
C29  10µF 16V  [CAPC1608L]
C30  100nF 50V  [CAPC1005N]
D1  PMEG4050EP  [SOD4725X110]
D2  LED  [LEDM1608X11_Green]
IC12  TPS63031DSKR  [SON50P250X80_HS-11N]
IC13  MCP73831T-2ACI/OT  [SOT95P275X110-5N]
L2  2,2µH 1,8A  [IND_WE_TPC_2828]
Q1  SI2301CDS-T1-GE3  [SOT95P237X112-3N]
Q2  2N7002  [SOT95P237X100-3N]
Q3  2N7002  [SOT95P237X100-3N]
R26  27k  [RESC1005L]
R27  3,3k  [RESC1005L]
R28  10k  [RESC1005L]
R29  10k  [RESC1005L]
R35  10k  [RESC1005L]
R36  470R  [RESC1005L]
SW4  WE_450404015514  [WE_450404015514]

### Ports
3V3 (out), 5V (in), CHR0 (in), CHREN (in), GND (bidir), I_Sense (out)

### Nets
3V3: C26.2 IC12.1(VOUT) IC12.10(FB) ; port 3V3
5V: C27.2 D1.2(A) IC13.4(VDD) Q1.1(G) R35.2 R36.2 ; port 5V
GND: AUX2.1 C26.1 C27.1 C28.1 C29.1 C30.1 IC12.3(PGND) IC12.9(GND) IC12.11(EP) IC13.2(VSS) Q2.2(S) Q3.2(S) R28.1 R29.1 R35.1 SW4.S(Case) ; port GND
BAT+: AUX1.1 C28.2 IC13.3(VBAT) Q1.3(D)
CHR0: Q3.1(G) R29.2 ; port CHR0
CHREN: Q2.1(G) R28.2 ; port CHREN
I_Sense: IC13.5(PROG) R26.1 R27.2 ; port I_Sense
NetC29_2: C29.2 D1.1(K) Q1.2(S) SW4.2
NetC30_2: C30.2 IC12.6(EN) IC12.7(PS/SYNC) IC12.8(VINA)
NetD2_1: D2.1 R36.1
NetD2_2: D2.2 IC13.1(STAT)
NetIC12_2: IC12.2(L2) L2.2
NetIC12_4: IC12.4(L1) L2.1
NetIC12_5: IC12.5(VIN) SW4.1
NetQ2_3: Q2.3(D) R26.2
NetQ3_3: Q3.3(D) R27.1

Not connected (* = marked no-connect by the designer): SW4 3*

### Notes on the sheet
- Date/Datum
- Name
- Identification No./Modell Nr.
- Classification/
- Checked
- Approved
- Issued
- Designation/Benennung
- Revision-Character/Versions-Buchstabe
- Verwendungsbereich
- Drawn/Hersteller
- Dept./Abt.
- iMAR Navigation GmbH
- Rev./Ver.
- Drawing No./Zeichnungsnummer
- Sheet/Blatt
- /
- Im Reihersbruch 3
- D-66386 St. Ingbert
- www.imar.de <http://www.imar.de>
- Filename/Dateiname
- Format
- A3

### Library data of the parts
AUX1 AUX2 = CMP-ROOT-0032-5: "Hilfs"-Pad auf PCB (um einer Kupferfläche ein definiertes Netz zuzuweisen); mit Lötstopmaske; ohne Pastenmaske
C26-C29 = CMP-002-0021-13: as C1 on sheet Microcontroller; Case/Package: 0603; Kategorie: X5R; iComment: 10µF 16V; Tolerance: 10%; Mount: SMD; RoHS: Yes; Value: 10µF; Capacitor_Type: Ceramic; Manufacturer: unspecified; Voltage: 16V
C30 = CMP-002-0216-3: as C2 on sheet Microcontroller; iComment: 100nF 50V; Capacitor_Type: Ceramic; Voltage: 50V; Mount: SMD; Case/Package: 0402; Manufacturer: unspecified; Kategorie: X7R; Tolerance: 10%; RoHS: Yes; Value: 100nF
D1 = CMP-016-0016-9: Schottky-Diode 5A low Vf; Manufacturer_PN: PMEG4050EP,115; Manufacturer: NEXPERIA; Temperature_max: 150°C; Failure_in_Time_notes: Ground Benign; MIL_HDBK_217F; Power Rectifier/ Schottky Pwr.; Ub: 40V; iMAR_PN: 00001-08163-0000; Uf: 430mV; Failure_in_Time_value: 0,0028; Temperature_min: -55°C; Power: 625mW; RoHS: Yes; Case/Package: SOD128; Mount: SMD; Pins: 2; Type: Schottky; If: 5A
D2 = CMP-008-0005-11: LED green 0603 2,2V 20mA; Manufacturer_PN: KP-1608SGC; Manufacturer: KINGBRIGHT; Temperature_max: 85°C; Uf_max: 2,5V; Ub: 5V; Temperature_min: -40°C; Uf: 2.2V; Failure_in_Time_notes: Ground Benign; MIL_HDBK_217F; Opto-Electronic/ Emitter; iMAR_PN: 00001-06615-0001; Power: 62.5mW; Failure_in_Time_value: 0,00047; Color: Green; Mount: SMD; Case/Package: 0603; Pins: 2; RoHS: Yes; If: 20mA; Type: LED
IC12 = CMP-ROOT-00527-1: High Efficient Single Inductor Buck-Boost Converter with 1-A Switches; Manufacturer: TEXAS INSTRUMENTS; Temperature_max: 125°C; Iout1: 1A; Temperature_min: -40°C; Vin_max: 5.5V; Vin_min: 1.8V; Power: 1W; Vout1: 3.3V; Mount: SMD; RoHS: Yes; Manufacturer_PN: TPS63031DSKR; Case/Package: WSON-10
IC13 = CMP-00018-3: Li-Polymer Charge Management Controller; Manufacturer: MICROCHIP TECHNOLOGY; Temperature_min: -40°C; Temperature_max: 125°C; iMAR_PN: 00001-08544-0000; Uin_max: 6V; Uin_min: 3.75V; RoHS: Yes; Pins: 5; Type: PMIC; Mount: SMD; Case/Package: SOT-23; Manufacturer_PN: MCP73831T-2ACI/OT
L2 = CMP-ROOT-00259-4: WE-TPC  2,2µH  1,8A  2,4A  0,057R; Manufacturer: WUERTH ELEKTRONIK; Manufacturer_PN: 744025002; Heigth: 2,8mm; Temperature_min: -40°C; Current_Saturation: 2.4A; Value: 2.2µH; iMAR_PN: 00001-06703-0002; Resistance: 57m; Temperature_max: 125°C; Current_Rated: 1.8A; Case/Package: TPC-2828; RoHS: Yes; Mount: SMD; Length: 2,8mm; Width: 2,8mm
Q1 = CMP-ROOT-0274-2: Leistungs-MOSFET, p-Kanal, 20 V, 3.1 A, 0.09 ohm, SOT-23, Oberflächenmontage; Manufacturer: VISHAY; Temperature_min: -55°C; Ids: 3.1A; Uds_max: -20V; Ciss: 405pF; Ugth: -1V; Ugs_max: 8V; Polarity: P; Mode: enhancement; iMAR_PN: 00001-09121-0000; Power: 1.6W; Temperature_max: 150°C; Type: MOSFET; RDSon: 90m; Case/Package: SOT23-3; RoHS: Yes; Manufacturer_PN: SI2301CDS-T1-GE3; Mount: SMD
Q2 Q3 = CMP-ROOT-0165-6: Leistungs-MOSFET, n-Kanal, 60 V, 115 mA, 1.2 ohm, SOT-23, Oberflächenmontage; Manufacturer: ON SEMICONDUCTOR; Ugth: 2.1V; Mode: enhancement; Temperature_min: -55°C; Ugs_max: 20V; Polarity: N; Failure_in_Time_value: 0,014; Temperature_max: 150°C; Ciss: 20pF; Ids: 115mA; iMAR_PN: 00001-07152-0001; Power: 200mW; RDSon: 1.2; Uds_max: 60V; Type: MOSFET; Failure_in_Time_notes: Ground Benign; MIL_HDBK_217F; Transistor/ Si. Field Effect (f <= 400MHz); Case/Package: SOT23; RoHS: Yes; Mount: SMD; Manufacturer_PN: 2N7002
R26 = CMP-001-0280-23: 27k  0402  62mW  1%  100ppm  50V; Manufacturer_PN: unspecified; TK: ±100; Failure_in_Time_value: 0,0001; iMAR_PN: 00001-09097-0000; Temperature_min: -40°C; Failure_in_Time_notes: 55°C, 60% Upper Confidence Level; Daten von Vishay verwendet; Temperature_max: 125°C; Mount: SMD; RoHS: Yes; Case/Package: 0402; iComment: 27k; Value: 27k; Power: 62mW; Voltage: 50V; Tolerance: 1%; Manufacturer: unspecified
R27 = CMP-001-0258-23: 3,3k  0402  62mW  1%  100ppm  50V; Manufacturer_PN: unspecified; Temperature_min: -40°C; Failure_in_Time_value: 0,0001; Value: 3.3k; Temperature_max: 125°C; iMAR_PN: 00001-07280-0000; TK: ±100; Failure_in_Time_notes: 55°C, 60% Upper Confidence Level; Daten von Vishay verwendet; Power: 62mW; RoHS: Yes; Manufacturer: unspecified; Tolerance: 1%; Mount: SMD; Case/Package: 0402; iComment: 3.3k; Voltage: 50V
R28 R29 R35 = CMP-001-0270-23: as R18 on sheet Microcontroller; RoHS: Yes; Value: 10k; Mount: SMD; iComment: 10k; Case/Package: 0402; Power: 62mW; Manufacturer_PN: unspecified; Tolerance: 1%; Voltage: 50V
R36 = CMP-001-0238-23: 470R  0402  62mW  1%  100ppm  50V; Manufacturer: unspecified; Failure_in_Time_value: 0,0001; TK: ±100; Value: 470; Failure_in_Time_notes: 55°C, 60% Upper Confidence Level; Daten von Vishay verwendet; Temperature_max: 125°C; Temperature_min: -40°C; iMAR_PN: 00001-07655-0000; Power: 62mW; Voltage: 50V; Manufacturer_PN: unspecified; RoHS: Yes; Tolerance: 1%; Case/Package: 0402; iComment: 470; Mount: SMD
SW4 = CMP-ROOT-00315-3: WS-SLSU Mini Slide Switch; Manufacturer: WUERTH ELEKTRONIK; iMAR_PN: 00001-00035-0000; IR: 300mA; Temperature_min: -40°C; Temperature_max: 85°C; Mount: SMD; Pins: 3; Manufacturer_PN: 450404015514; RoHS: Yes; Case/Package: 450404015514

## Sheet Connectors.SchDoc
size 393 x 281 mm; DocumentNumber: 4; SheetNumber: 4; SheetTotal: 7; Format: A3; Abteilung: Entwicklung
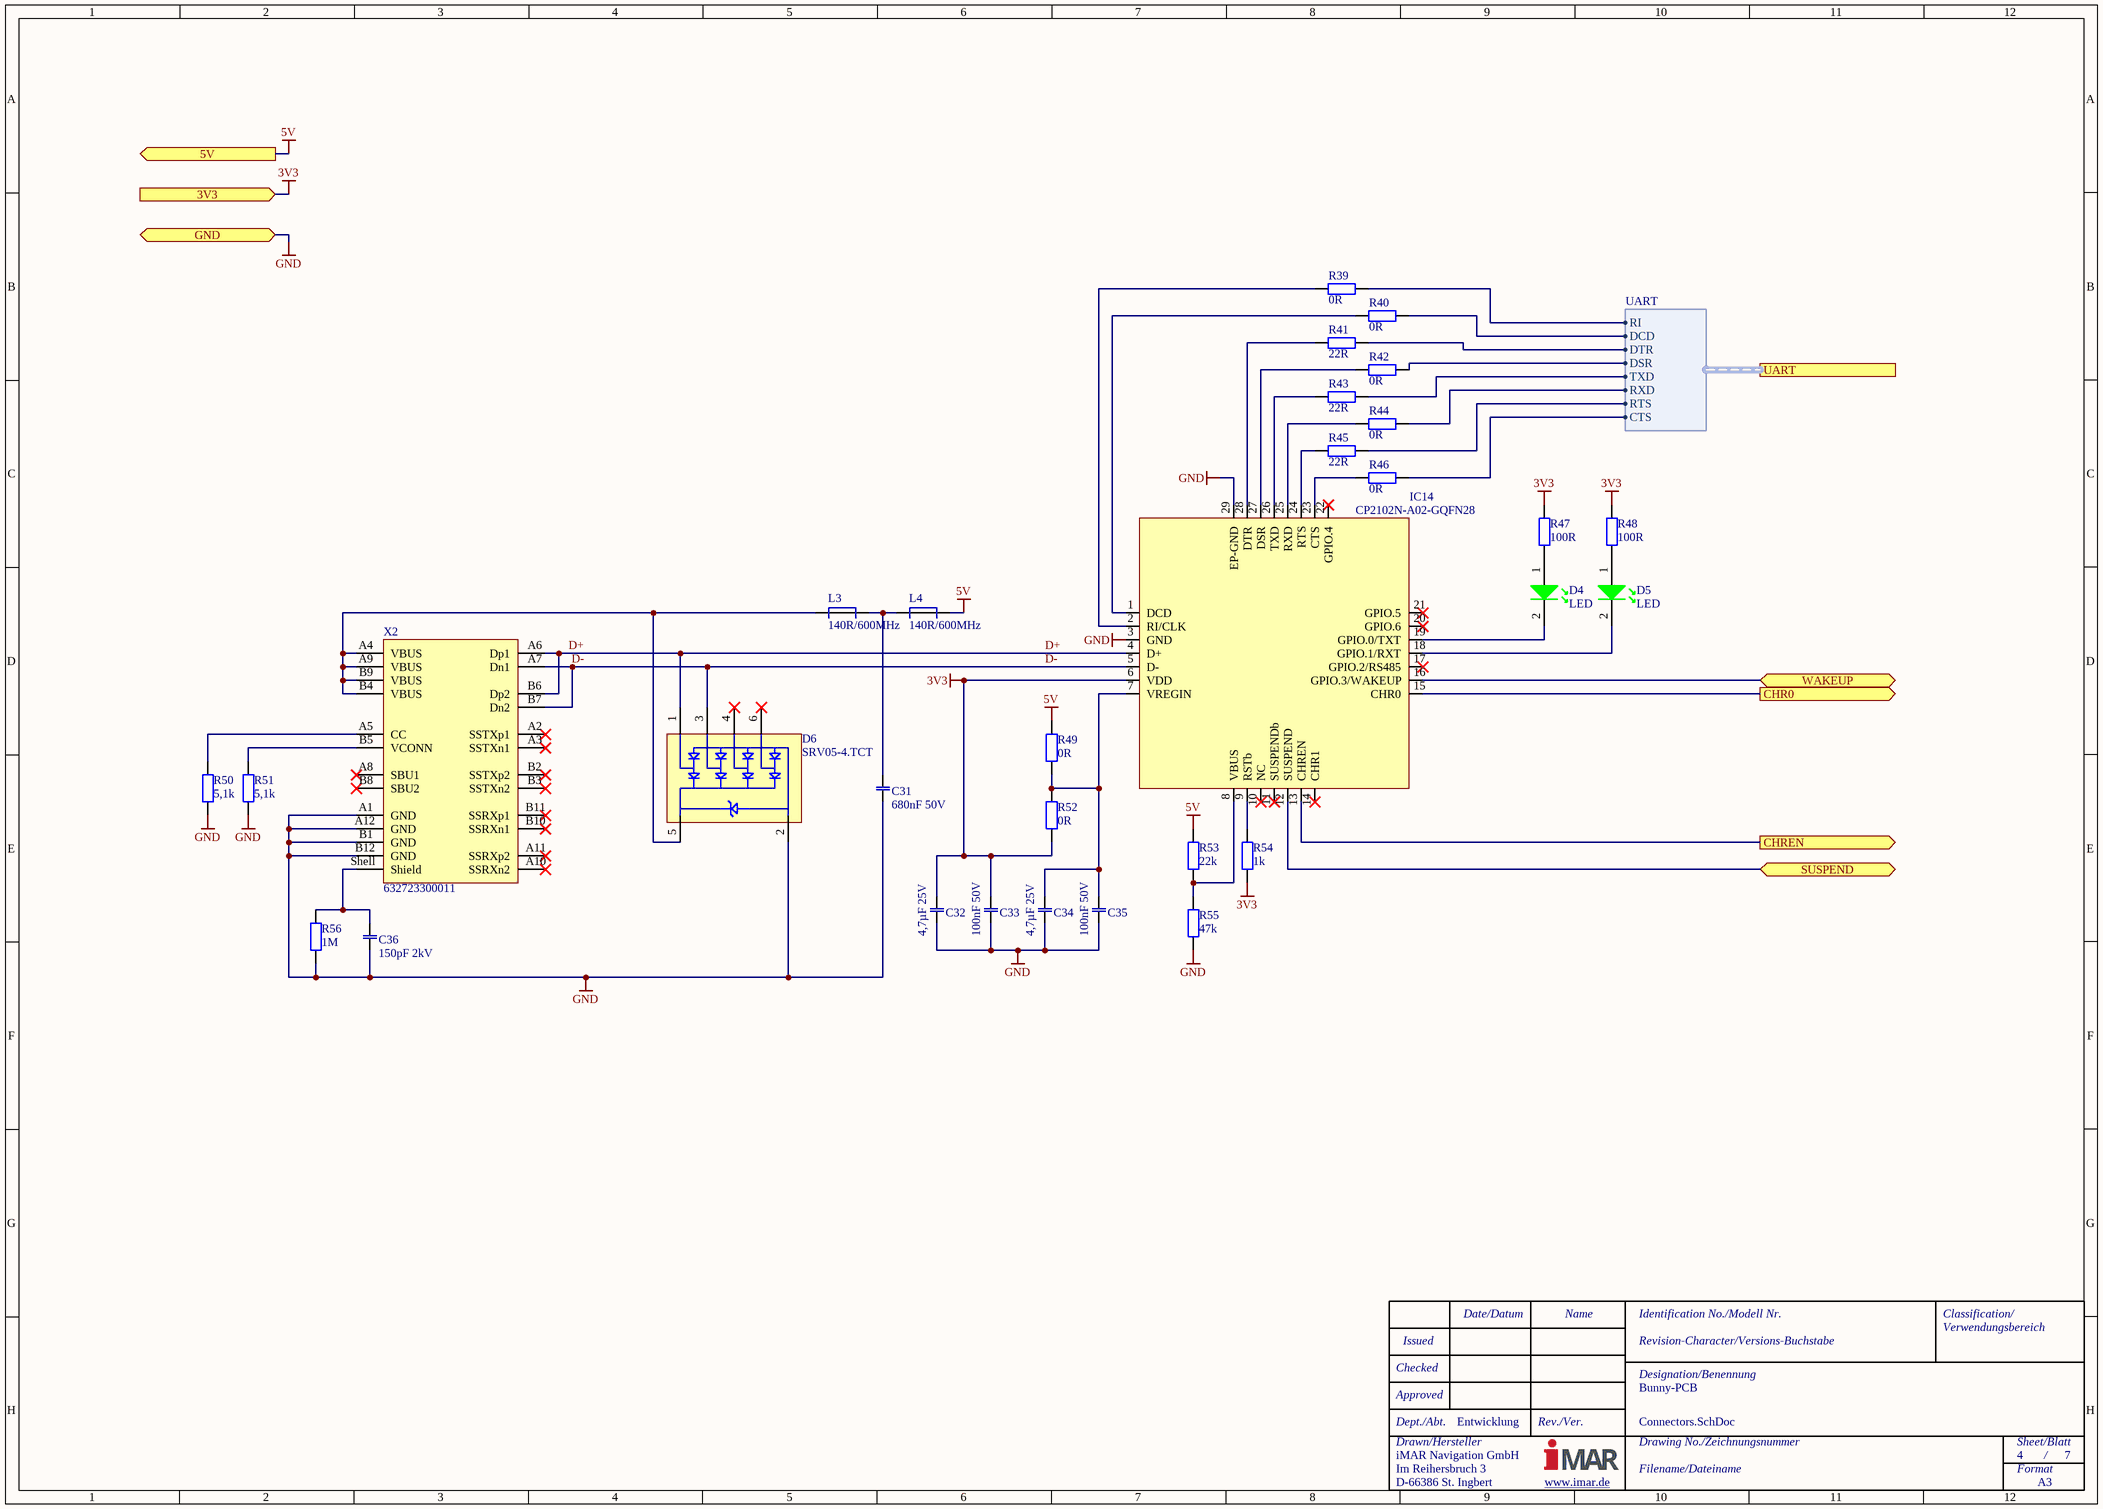
[diagram p6: Connectors.SchDoc]

### Parts
C31  680nF 50V  [CAPC1608L]
C32  4,7µF 25V  [CAPC1608L]
C33  100nF 50V  [CAPC1005N]
C34  4,7µF 25V  [CAPC1608L]
C35  100nF 50V  [CAPC1005N]
C36  150pF 2kV  [CAPC3216L]
D4  LED  [LEDM1608X11_Green]
D5  LED  [LEDM1608X11_Green]
D6  SRV05-4.TCT  [SOT95P280X110-6N]
IC14  CP2102N-A02-GQFN28  [QFN50P500X500X80_HS-29N]
L3  140R/600MHz  [INDC1005X06N]
L4  140R/600MHz  [INDC1005X06N]
R39  0R  [RESC1005L]
R40  0R  [RESC1005L]
R41  22R  [RESC1005L]
R42  0R  [RESC1005L]
R43  22R  [RESC1005L]
R44  0R  [RESC1005L]
R45  22R  [RESC1005L]
R46  0R  [RESC1005L]
R47  100R  [RESC1005L]
R48  100R  [RESC1005L]
R49  0R  [RESC1005L]
R50  5,1k  [RESC1005L]
R51  5,1k  [RESC1005L]
R52  0R  [RESC1005L]
R53  22k  [RESC1005L]
R54  1k  [RESC1005L]
R55  47k  [RESC1005L]
R56  1M  [RESC2012L]
X2  632723300011  [WE_632723300011]

### Ports
3V3 (in), 5V (out), CHR0 (out), CHREN (out), GND (bidir), SUSPEND (bidir), UART (harness UART), WAKEUP (bidir)

### Harnesses
UART: RXD, DSR, DTR, RTS, CTS, TXD, DCD, RI

### Nets
3V3: C32.2 C33.2 IC14.6(VDD) R47.2 R48.2 R52.2 R54.1 ; port 3V3
5V: L4.2 R49.2 R53.2 ; port 5V
GND: C31.1 C32.1 C33.1 C34.1 C35.1 C36.1 D6.2 IC14.3(GND) IC14.29(EP-GND) R50.1 R51.1 R55.1 R56.1 X2.A1(GND) X2.A12(GND) X2.B1(GND) X2.B12(GND) ; port GND
CHR0: IC14.15(CHR0) ; port CHR0
CHREN: IC14.13(CHREN) ; port CHREN
D+: D6.1 IC14.4(D+) X2.A6(Dp1) X2.B6(Dp2)
D-: D6.3 IC14.5(D-) X2.A7(Dn1) X2.B7(Dn2)
SUSPEND: IC14.12(SUSPEND) ; port SUSPEND
WAKEUP: IC14.16(GPIO.3/WAKEUP) ; port WAKEUP
NetC31_2: C31.2 L3.2 L4.1
NetC34_2: C34.2 C35.2 IC14.7(VREGIN) R49.1 R52.1
NetC36_2: C36.2 R56.2 X2.Shell(Shield)
NetD4_1: D4.1 R47.1
NetD4_2: D4.2 IC14.19(GPIO.0/TXT)
NetD5_1: D5.1 R48.1
NetD5_2: D5.2 IC14.18(GPIO.1/RXT)
NetD6_5: D6.5 L3.1 X2.A4(VBUS) X2.A9(VBUS) X2.B4(VBUS) X2.B9(VBUS)
NetIC1_16: R45.1 ; port UART.RTS
NetIC1_26: R43.2 ; port UART.TXD
NetIC14_1: IC14.1(DCD) R40.1
NetIC14_2: IC14.2(RI/CLK) R39.1
NetIC14_8: IC14.8(VBUS) R53.1 R55.2
NetIC14_9: IC14.9(RSTb) R54.2
NetIC14_23: IC14.23(CTS) R46.1
NetIC14_24: IC14.24(RTS) R45.2
NetIC14_25: IC14.25(RXD) R44.1
NetIC14_26: IC14.26(TXD) R43.1
NetIC14_27: IC14.27(DSR) R42.1
NetIC14_28: IC14.28(DTR) R41.2
NetR10_2: R44.2 ; port UART.RXD
NetR12_2: R46.2 ; port UART.CTS
NetR39_2: R39.2 ; port UART.RI
NetR40_2: R40.2 ; port UART.DCD
NetR41_1: R41.1 ; port UART.DTR
NetR42_2: R42.2 ; port UART.DSR
NetR50_2: R50.2 X2.A5(CC)
NetR51_2: R51.2 X2.B5(VCONN)

Not connected (* = marked no-connect by the designer): D6 4* 6*; IC14 10(NC)* 11(SUSPENDb)* 14(CHR1)* 17(GPIO.2/RS485)* 20(GPIO.6)* 21(GPIO.5)* 22(GPIO.4)*; X2 A2(SSTXp1)* A3(SSTXn1)* A8(SBU1)* A10(SSRXn2)* A11(SSRXp2)* B2(SSTXp2)* B3(SSTXn2)* B8(SBU2)* B10(SSRXn1)* B11(SSRXp1)*

### Notes on the sheet
- Date/Datum
- Name
- Identification No./Modell Nr.
- Classification/
- Checked
- Approved
- Issued
- Designation/Benennung
- Revision-Character/Versions-Buchstabe
- Verwendungsbereich
- Drawn/Hersteller
- Dept./Abt.
- iMAR Navigation GmbH
- Rev./Ver.
- Drawing No./Zeichnungsnummer
- Sheet/Blatt
- /
- Im Reihersbruch 3
- D-66386 St. Ingbert
- www.imar.de <http://www.imar.de>
- Filename/Dateiname
- Format
- A3

### Library data of the parts
C31 = CMP-002-0039-17: 680nF  50V  Ceramic  0603  10%  X5R; Manufacturer: unspecified; Failure_in_Time_notes: 55°C, 90% Upper Confidence Level, Daten von Wuerth verwendet; iMAR_PN: 00001-08266-0000; Temperature_max: 85°C; Failure_in_Time_value: 0,000123; Temperature_min: -55°C; Voltage: 50V; Tolerance: 10%; Kategorie: X5R; Value: 680nF; Manufacturer_PN: unspecified; RoHS: Yes; Capacitor_Type: Ceramic; Mount: SMD; iComment: 680nF 50V; Case/Package: 0603
C32 C34 = CMP-002-0204-3: 4,7µF  25V  Ceramic  0603  10%  X5R; Manufacturer_PN: unspecified; Temperature_min: -55°C; Temperature_max: 85°C; iMAR_PN: 00001-08279-0000; Failure_in_Time_notes: 55°C, 90% Upper Confidence Level, Daten von Wuerth verwendet; Failure_in_Time_value: 0,000123; iComment: 4.7µF 25V; Value: 4.7µF; RoHS: Yes; Manufacturer: unspecified; Mount: SMD; Capacitor_Type: Ceramic; Voltage: 25V; Kategorie: X5R; Tolerance: 10%; Case/Package: 0603
C33 C35 = CMP-002-0216-3: as C2 on sheet Microcontroller; iComment: 100nF 50V; Capacitor_Type: Ceramic; Voltage: 50V; Mount: SMD; Case/Package: 0402; Manufacturer: unspecified; Kategorie: X7R; Tolerance: 10%; RoHS: Yes; Value: 100nF
C36 = CMP-002-0122-7: 150pF  2kV  Ceramic  1206  10%  X7R; Manufacturer: unspecified; Failure_in_Time_notes: 55°C, 90% Upper Confidence Level, Daten von Wuerth verwendet; iMAR_PN: 00001-08264-0000; Failure_in_Time_value: 0,000123; Temperature_min: -55°C; Temperature_max: 125°C; Mount: SMD; Capacitor_Type: Ceramic; RoHS: Yes; Kategorie: X7R; Value: 150pF; Tolerance: 10%; iComment: 150pF 2kV; Case/Package: 1206; Voltage: 2kV; Manufacturer_PN: unspecified
D4 D5 = CMP-008-0005-11: as D2 on sheet Power; Color: Green; Mount: SMD; Case/Package: 0603; Pins: 2; RoHS: Yes; If: 20mA; Type: LED
D6 = CMP-016-0045-9: Low Capacitance TVS Diode Array,USB, 10/100/1000 ETH; Manufacturer: SEMTECH; Temperature_max: 125°C; Type: TVS-Array; Failure_in_Time_value: 0,00038; Uf: 1.2V; iMAR_PN: 00001-07255-0000; Temperature_min: -55°C; Ub: 6V; Failure_in_Time_notes: 55°C (Junction), 90% Upper Confidence Level; Daten von ON Semiconductor; Power: 300W; If: 12A; Mount: SMD; Pins: 6; RoHS: Yes; Case/Package: SOT-23; Manufacturer_PN: SRV05-4.TCT
IC14 = CMP-ROOT-00311-6: USB-IC-Schnittstelle USBXpress - USB to UART Bridge; Manufacturer: SILICON LABS; iMAR_PN: 00001-09090-0000; Temperature_min: -40°C; Temperature_max: 85°C; Mount: SMD; RoHS: Yes; Case/Package: QFN28; Manufacturer_PN: CP2102N-A02-GQFN28; Pins: 29
L3 L4 = CMP-007-0093-9: 140R/600MHz  1,2A  0402  WE-CBF SMD EMI Suppression Ferrite Bead; Manufacturer: WUERTH ELEKTRONIK; Manufacturer_PN: 742792731; Temperature_max: 85°C; Temperature_min: -55°C; Failure_in_Time_value: 0,00025; Current_Rated: 1.2A; Temperature_extended: 125°C; Impedance_100MHz: 100; iMAR_PN: 00001-07703-0000; Impedance_DC: 90m; Frequency: 600MHz; Impedance: 140; Failure_in_Time_notes: 90% UCL (lambda: 0,13; sigma: 0,09); Mount: SMD; RoHS: Yes; Case/Package: 0402
R39 R40 R42 R44 R46 R49 R52 = CMP-001-0173-26: as R8 on sheet Microcontroller; Voltage: 0V; Case/Package: 0402; Mount: SMD; Tolerance: 0%; TK: 0; RoHS: Yes; Manufacturer_PN: unspecified
R41 R43 R45 = CMP-001-0206-25: as R1 on sheet Microcontroller; RoHS: Yes; Power: 62mW; Manufacturer_PN: unspecified; Case/Package: 0402; Tolerance: 1%; Voltage: 50V; Mount: SMD
R47 R48 = CMP-001-0222-23: 100R  0402  62mW  1%  100ppm  50V; Manufacturer_PN: unspecified; iMAR_PN: 00001-06144-0003; Failure_in_Time_notes: 55°C, 60% Upper Confidence Level; Daten von Vishay verwendet; Value: 100; Temperature_max: 125°C; Failure_in_Time_value: 0,0001; TK: ±100; Temperature_min: -40°C; RoHS: Yes; Tolerance: 1%; Power: 62mW; Case/Package: 0402; Mount: SMD; Voltage: 50V; Manufacturer: unspecified; iComment: 100
R50 R51 = CMP-001-0263-23: 5,1k  0402  62mW  1%  100ppm  50V; Manufacturer_PN: unspecified; Temperature_min: -40°C; Temperature_max: 125°C; Value: 5.1k; Failure_in_Time_value: 0,0001; TK: ±100; iMAR_PN: 00001-08410-0000; Failure_in_Time_notes: 55°C, 60% Upper Confidence Level; Daten von Vishay verwendet; RoHS: Yes; Case/Package: 0402; Manufacturer: unspecified; Mount: SMD; iComment: 5.1k; Voltage: 50V; Power: 62mW; Tolerance: 1%
R53 = CMP-001-0278-22: 22k  0402  62mW  1%  100ppm  50V; Manufacturer: unspecified; Temperature_min: -40°C; TK: ±100; Failure_in_Time_notes: 55°C, 60% Upper Confidence Level; Daten von Vishay verwendet; Temperature_max: 125°C; iMAR_PN: 00001-08143-0000; Failure_in_Time_value: 0,0001; Voltage: 50V; Case/Package: 0402; Mount: SMD; Power: 62mW; Value: 22k; Tolerance: 1%; Manufacturer_PN: unspecified; RoHS: Yes; iComment: 22k
R54 = CMP-001-0246-24: 1k  0402  62mW  1%  100ppm  50V; Manufacturer: unspecified; Temperature_min: -40°C; Failure_in_Time_value: 0,0001; iMAR_PN: 00001-06144-0005; Temperature_max: 125°C; Failure_in_Time_notes: 55°C, 60% Upper Confidence Level; Daten von Vishay verwendet; TK: ±100; Power: 62mW; Value: 1k; Tolerance: 1%; Voltage: 50V; Mount: SMD; RoHS: Yes; iComment: 1k; Case/Package: 0402; Manufacturer_PN: unspecified
R55 = CMP-001-0286-24: as R9 on sheet Microcontroller; Power: 62mW; Manufacturer_PN: unspecified; Tolerance: 1%; Value: 47k; Mount: SMD; RoHS: Yes; iComment: 47k; Voltage: 50V; Case/Package: 0402
R56 = CMP-001-0148-18: 1M  0805  125mW  1%  100ppm  150V; Manufacturer_PN: unspecified; TK: ±100; Temperature_max: 125°C; Failure_in_Time_value: 0,0001; Failure_in_Time_notes: 55°C, 60% Upper Confidence Level; Daten von Vishay verwendet; Temperature_min: -40°C; iMAR_PN: 00001-00758-0000; Value: 1M; Mount: SMD; Manufacturer: unspecified; iComment: 1M; Power: 125mW; RoHS: Yes; Voltage: 150V; Tolerance: 1%; Case/Package: 0805
X2 = CMP-ROOT-00523-2: WR-COM USB 3.1 Type C Receptacle Horizontal THR / SMT; pin to pad: Shell>1+2+3+4+5+6+7+8; Manufacturer: WUERTH ELEKTRONIK; 3TG_Conformity: Yes; Temperature_min: -40°C; Number_of_Rows: 2; System: Connector; Temperature_max: 105°C; iMAR_PN: tbd; Pitch: 0,5; Connector_Type: btw; Pins: 24; Mount: TH; Manufacturer_PN: 632723300011; RoHS: Yes

## Nets that join several sheets
3V3: Microcontroller (13 pins), Display (5 pins), Sensors (31 pins), Power (C26.2 IC12.1 IC12.10), Connectors (7 pins)
5V: Power (6 pins), Connectors (L4.2 R49.2 R53.2)
GND: Microcontroller (22 pins), Display (C37.2 C38.2 IC15.16), Sensors (27 pins), Power (16 pins), Connectors (17 pins)
CHR0: Power (Q3.1 R29.2), Connectors (IC14.15)
CHREN: Power (Q2.1 R28.2), Connectors (IC14.13)
I_Sense: Microcontroller (R15.1), Power (IC13.5 R26.1 R27.2)
INT1_ACC: Microcontroller (IC1.29), Sensors (R31.1 R32.2)
INT2_ACC: Microcontroller (IC1.30), Sensors (IC10.9)
INT_CAP: Microcontroller (IC1.21), Sensors (IC9.5)
INT_lIGHT: Microcontroller (IC1.11), Sensors (IC6.7 R24.1)
INT_Pres: Microcontroller (R13.1), Sensors (IC7.7)
NetIC1_1: Microcontroller (IC1.1), Sensors (IC5.2 IC6.5 R23.1)
NetIC1_2: Microcontroller (IC1.2), Sensors (IC5.1 IC6.8 R22.1)
NetIC1_14: Microcontroller (IC1.14), Display (R60.1), Sensors (R25.1 R30.1)
NetIC1_16: Microcontroller (IC1.16), Connectors (R45.1)
NetIC1_19: Microcontroller (IC1.19), Sensors (IC8.9 IC9.1 R21.1)
NetIC1_20: Microcontroller (IC1.20), Sensors (IC8.10 IC9.2 R20.1)
NetIC1_26: Microcontroller (IC1.26), Connectors (R43.2)
NetIC7_2: Microcontroller (R5.2), Display (IC15.15), Sensors (IC7.2 IC10.13)
NetIC7_4: Microcontroller (R4.2), Display (IC15.2), Sensors (IC7.4 IC10.14)
NetIC7_6: Microcontroller (R2.2), Sensors (IC7.6)
NetIC10_12: Microcontroller (R3.2), Sensors (IC10.12)
NetIC15_10: Microcontroller (R7.2), Display (IC15.10)
NetR10_2: Microcontroller (R10.2), Connectors (R44.2)
NetR12_2: Microcontroller (R12.2), Connectors (R46.2)
PWM_DIM: Microcontroller (R1.2), Display (IC15.8)
SD_CAP: Microcontroller (IC1.18), Sensors (IC9.6)
SUSPEND: Microcontroller (IC1.8), Connectors (IC14.12)
WAKEUP: Microcontroller (IC1.10), Connectors (IC14.16)

## Assembly variants
000: not fitted C36 R8 R13 R15 R32 R39 R40 R41 R42 R49 R56